# Altium project 724452_RPL-HX_Mobile_AEP_Rev0p91.PrjPcb (part 12 of 13)

## Sheet 0091_USB3.SchDoc
size 848 x 558 mm
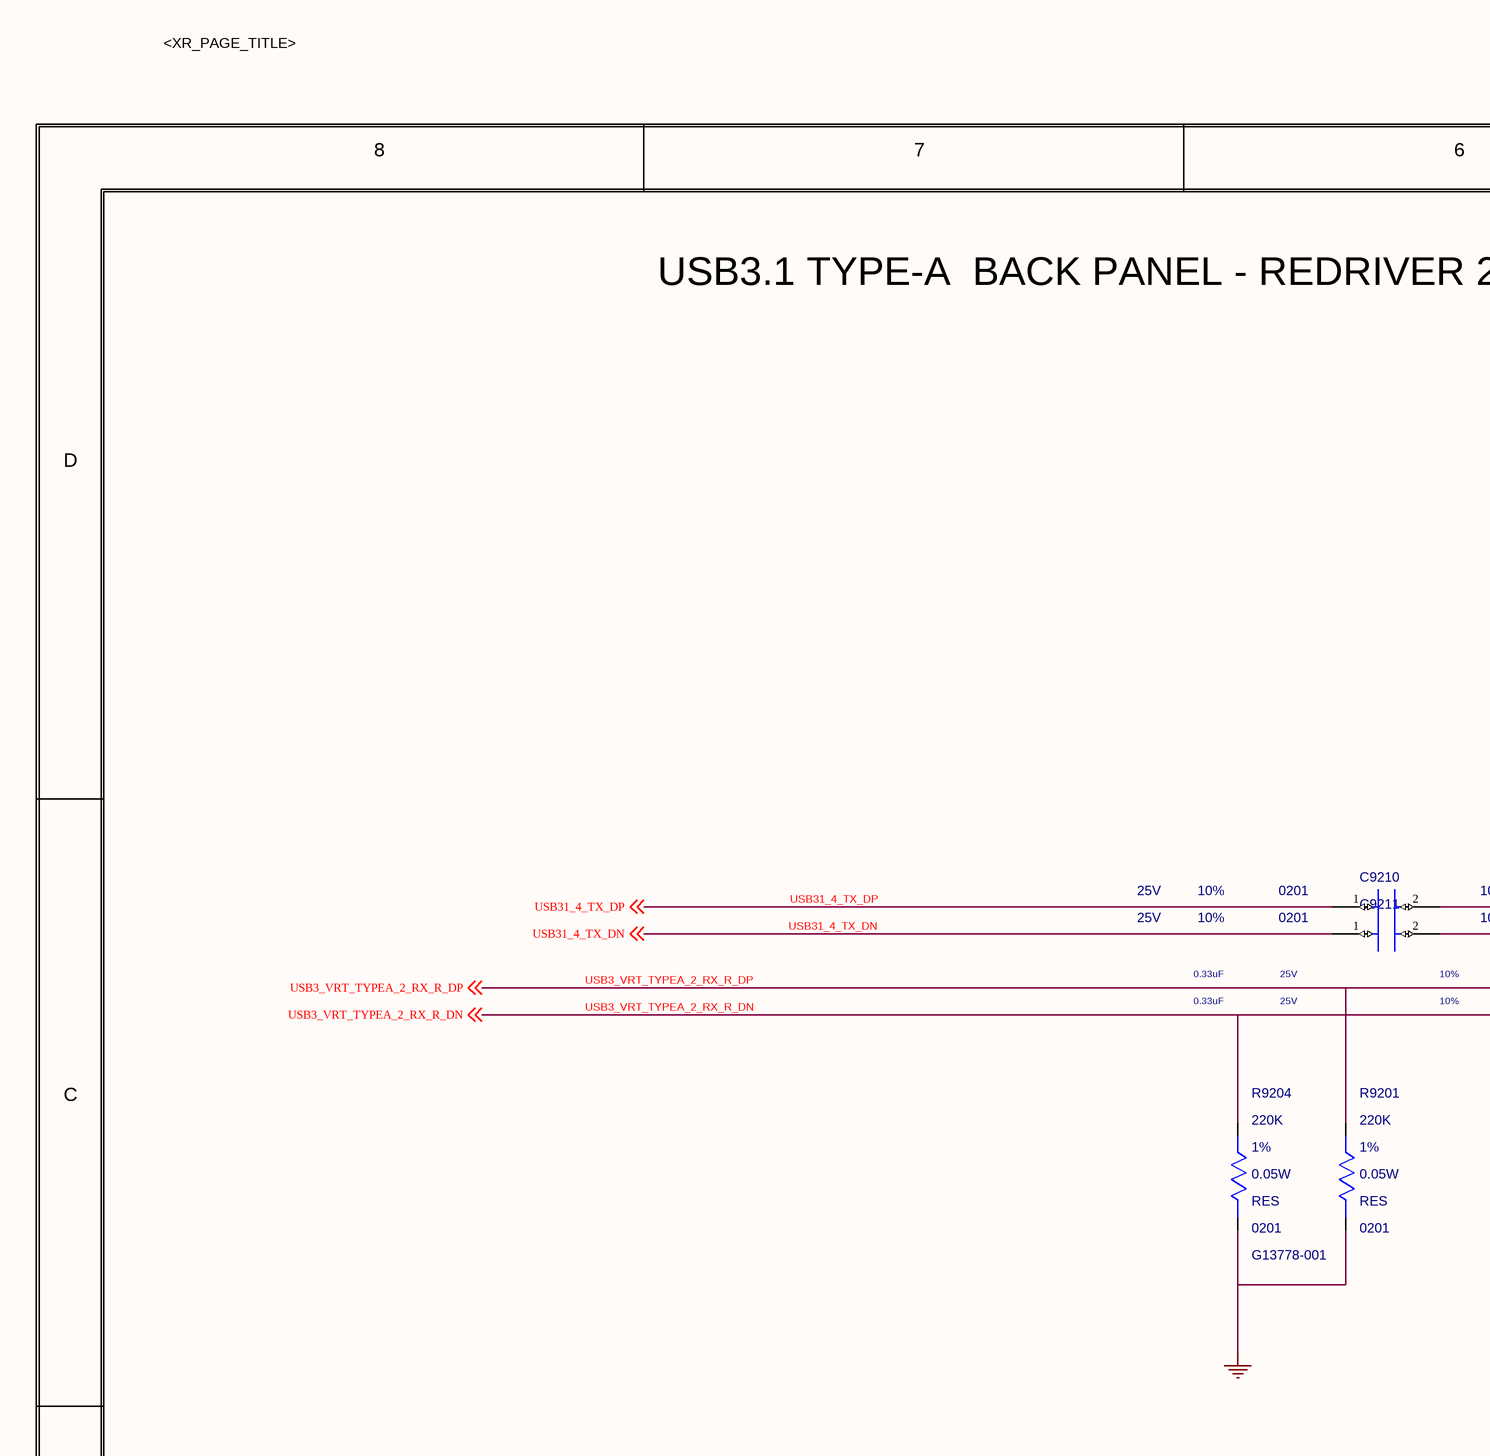
[diagram p154: 0091_USB3.SchDoc, top left]
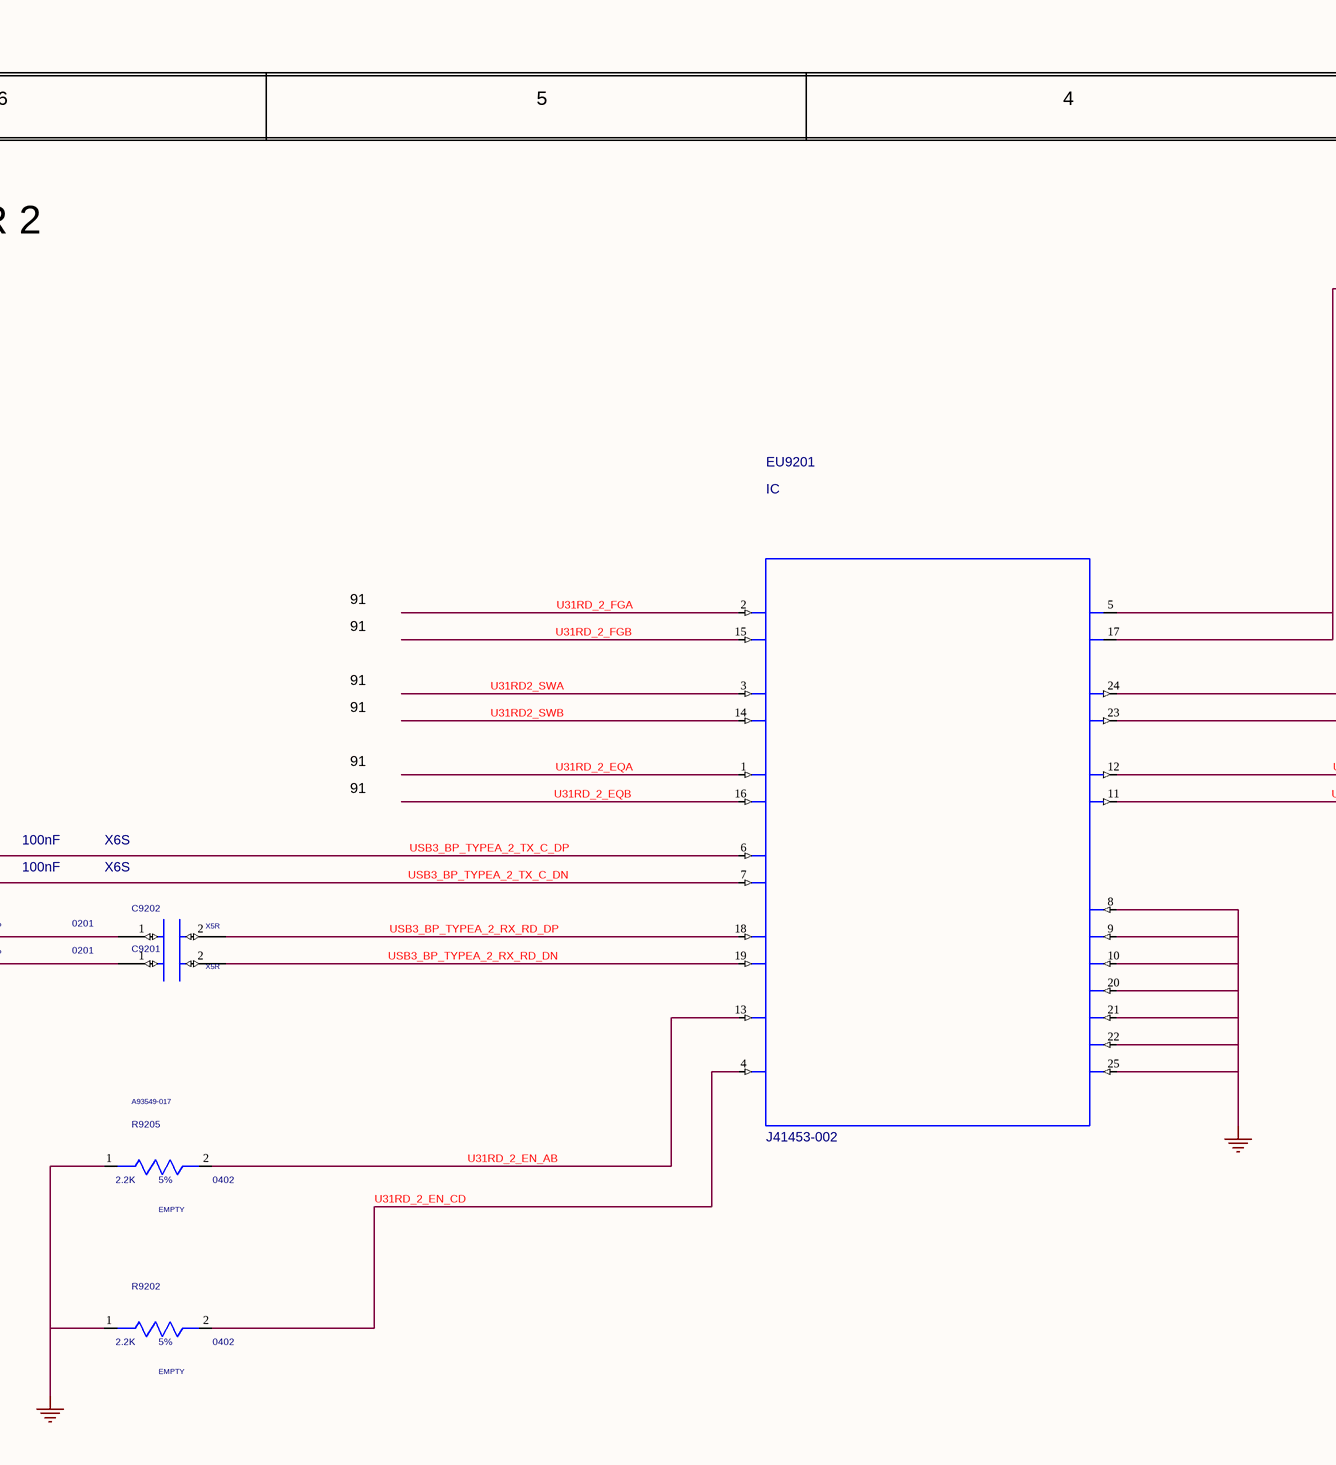
[diagram p155: 0091_USB3.SchDoc, top middle]
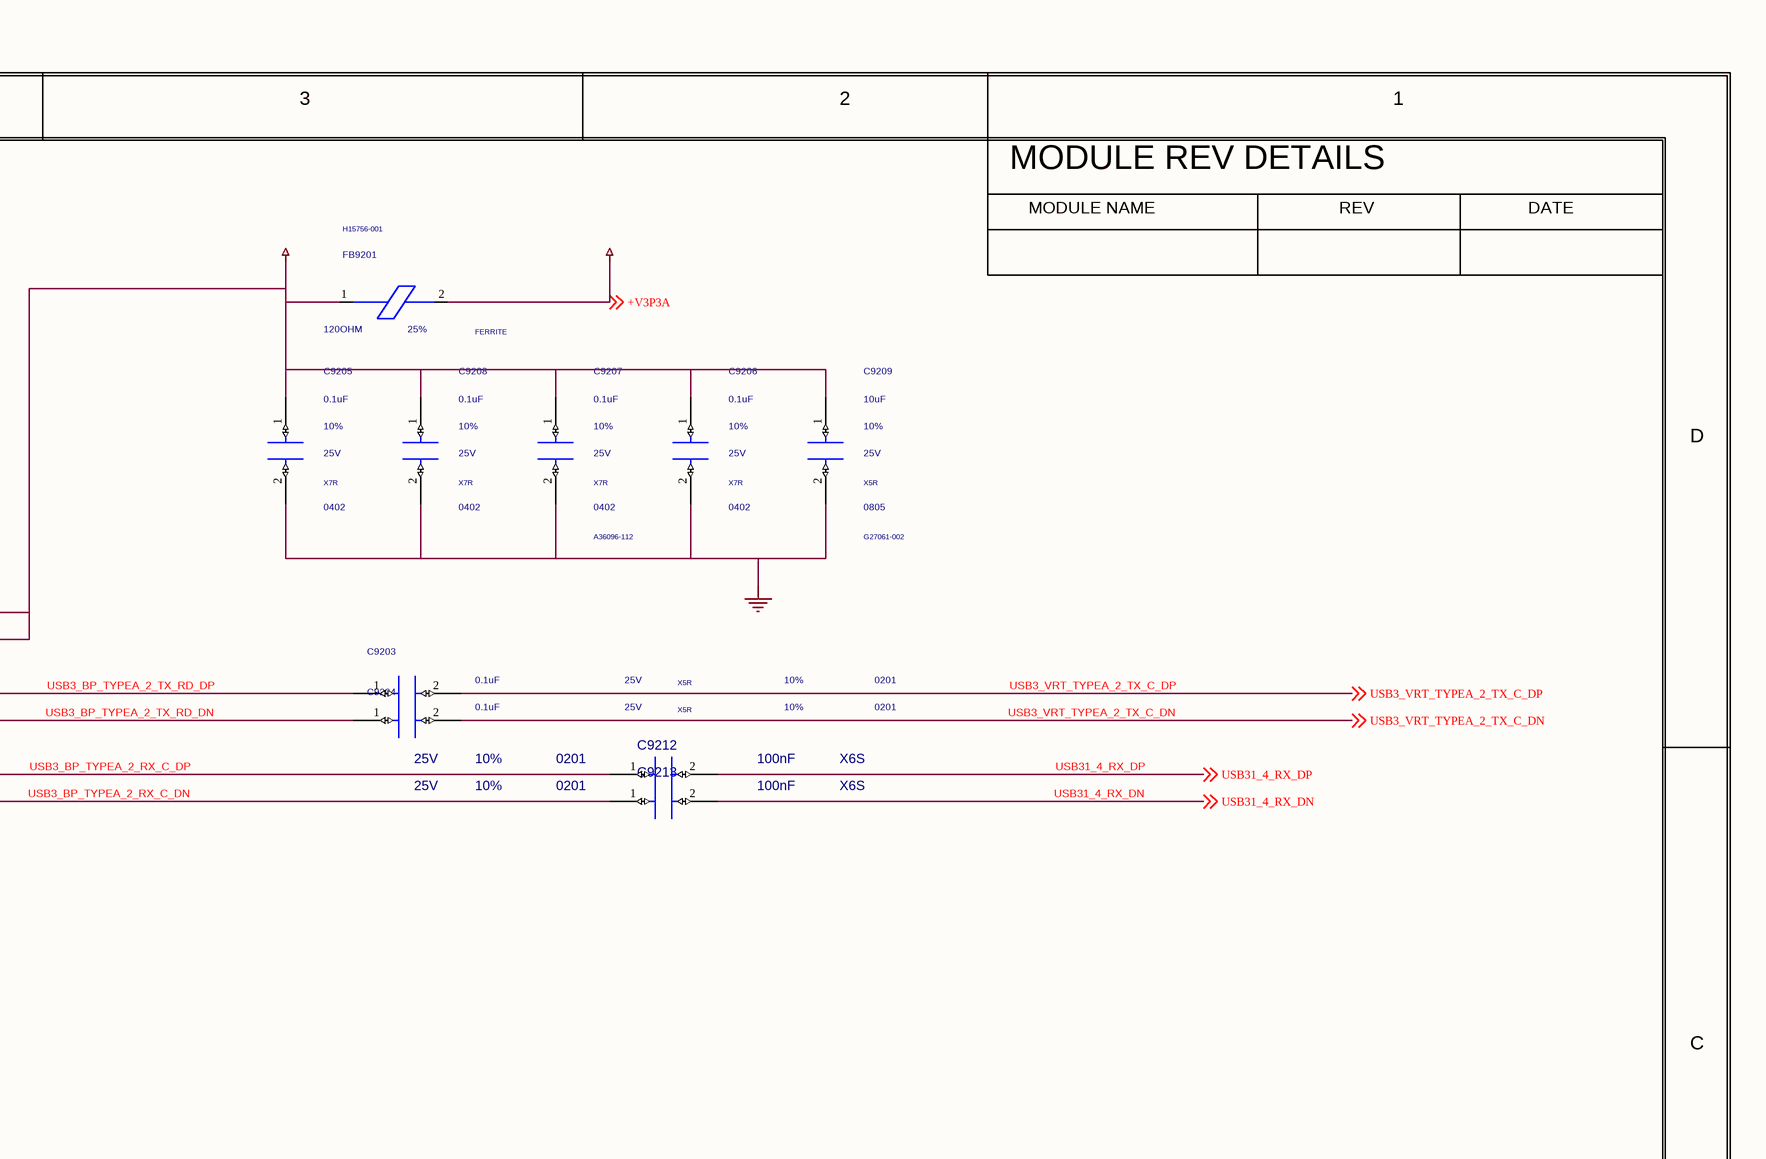
[diagram p156: 0091_USB3.SchDoc, top right]
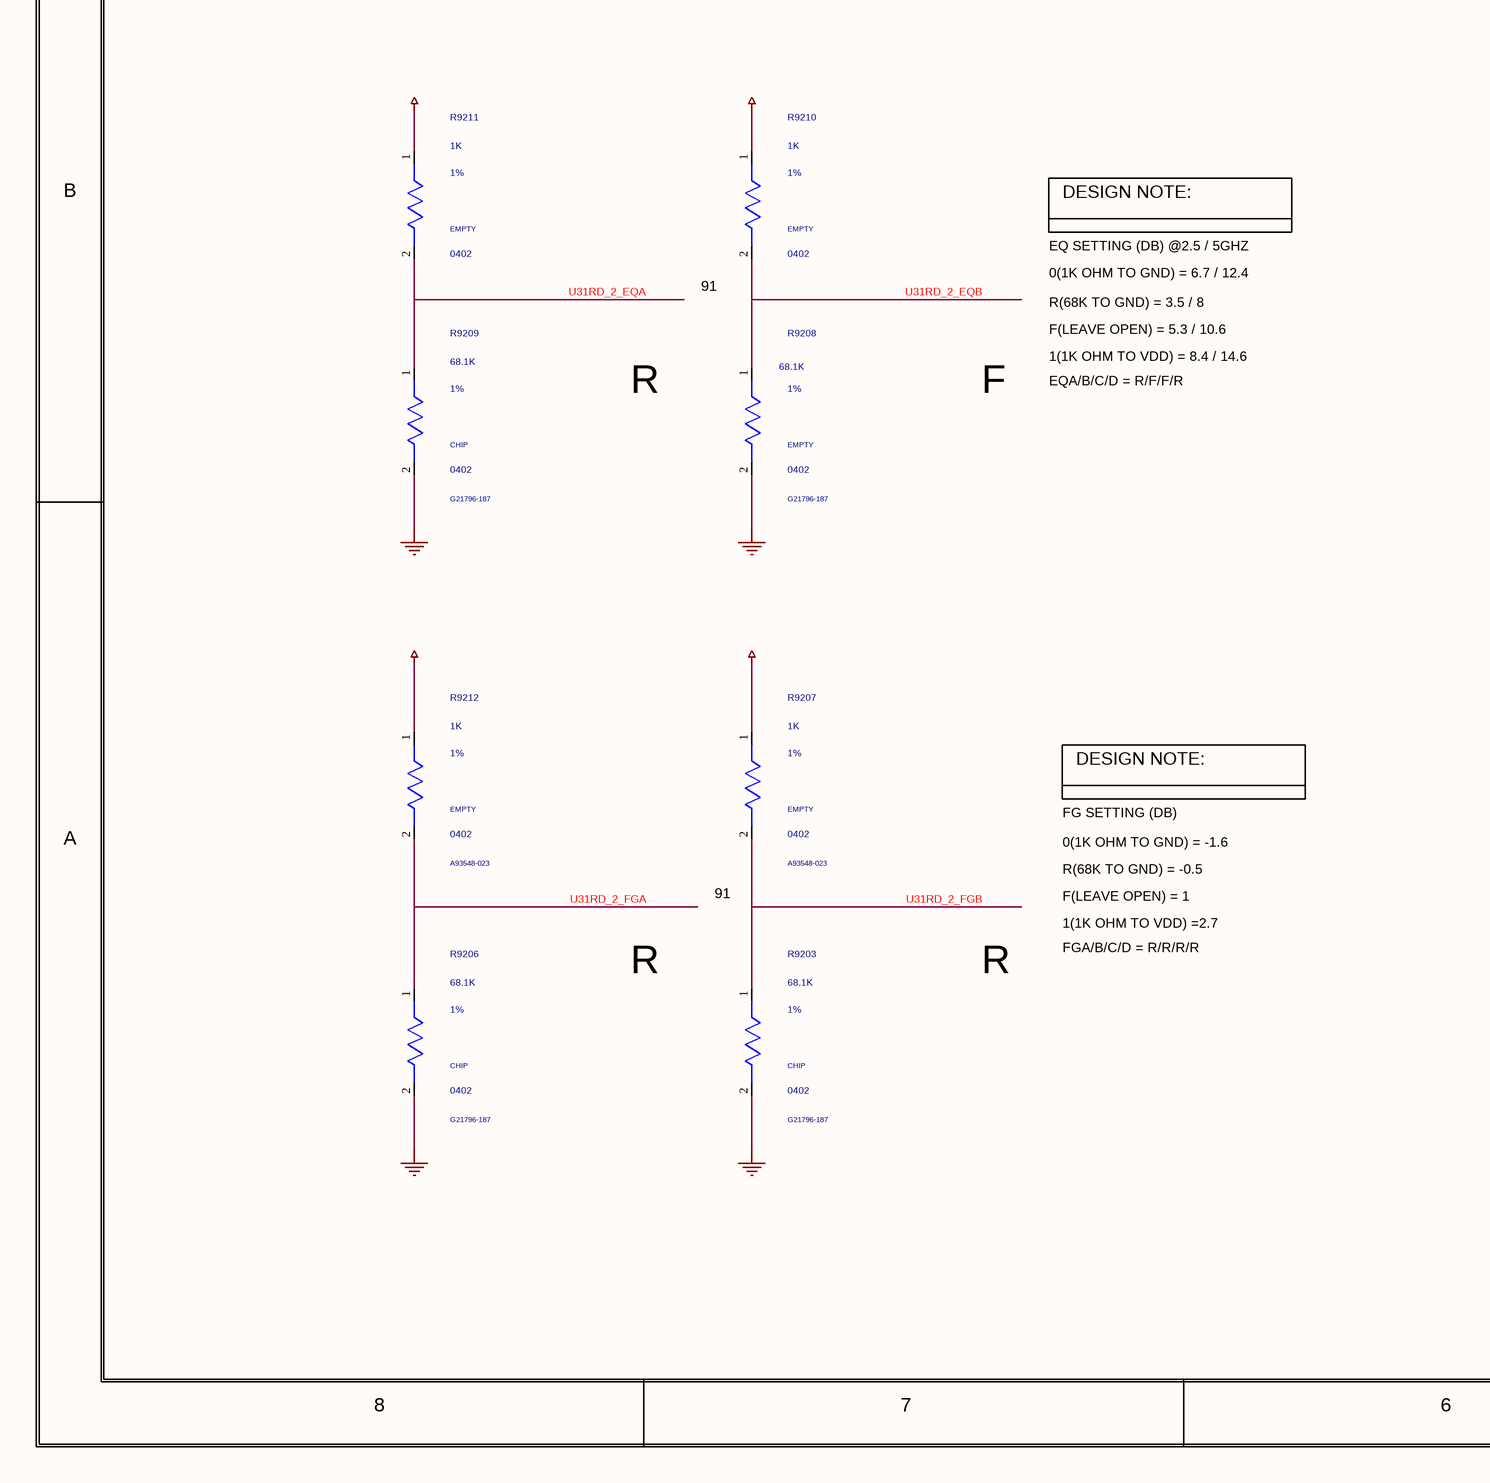
[diagram p157: 0091_USB3.SchDoc, bottom left]
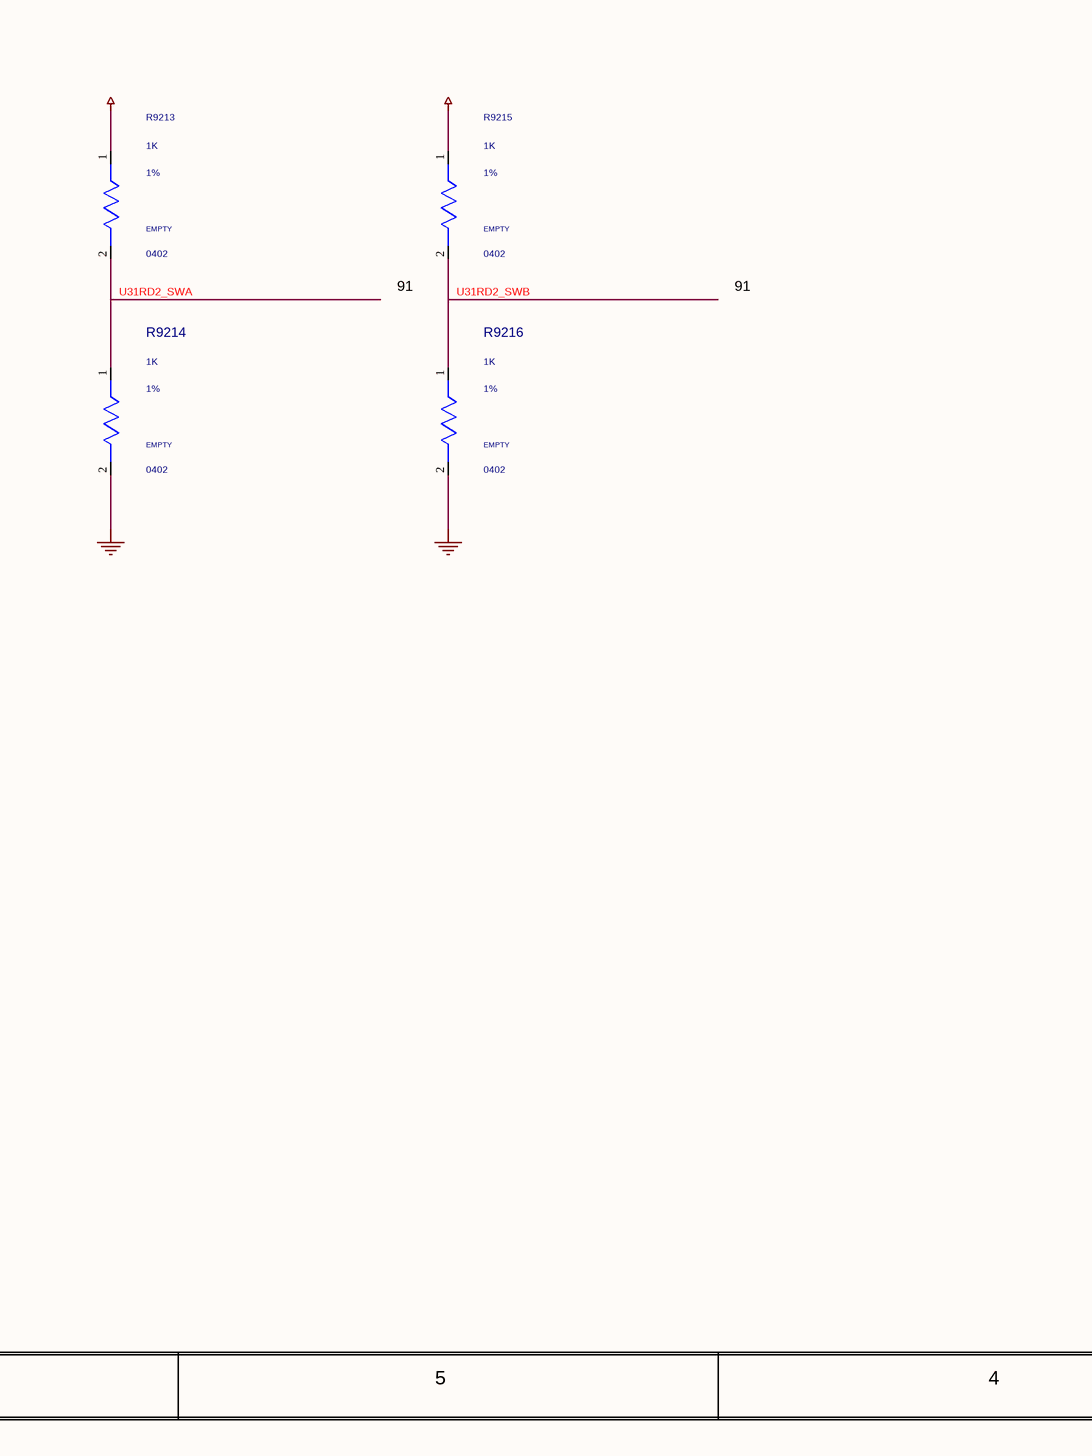
[diagram p158: 0091_USB3.SchDoc, bottom middle]
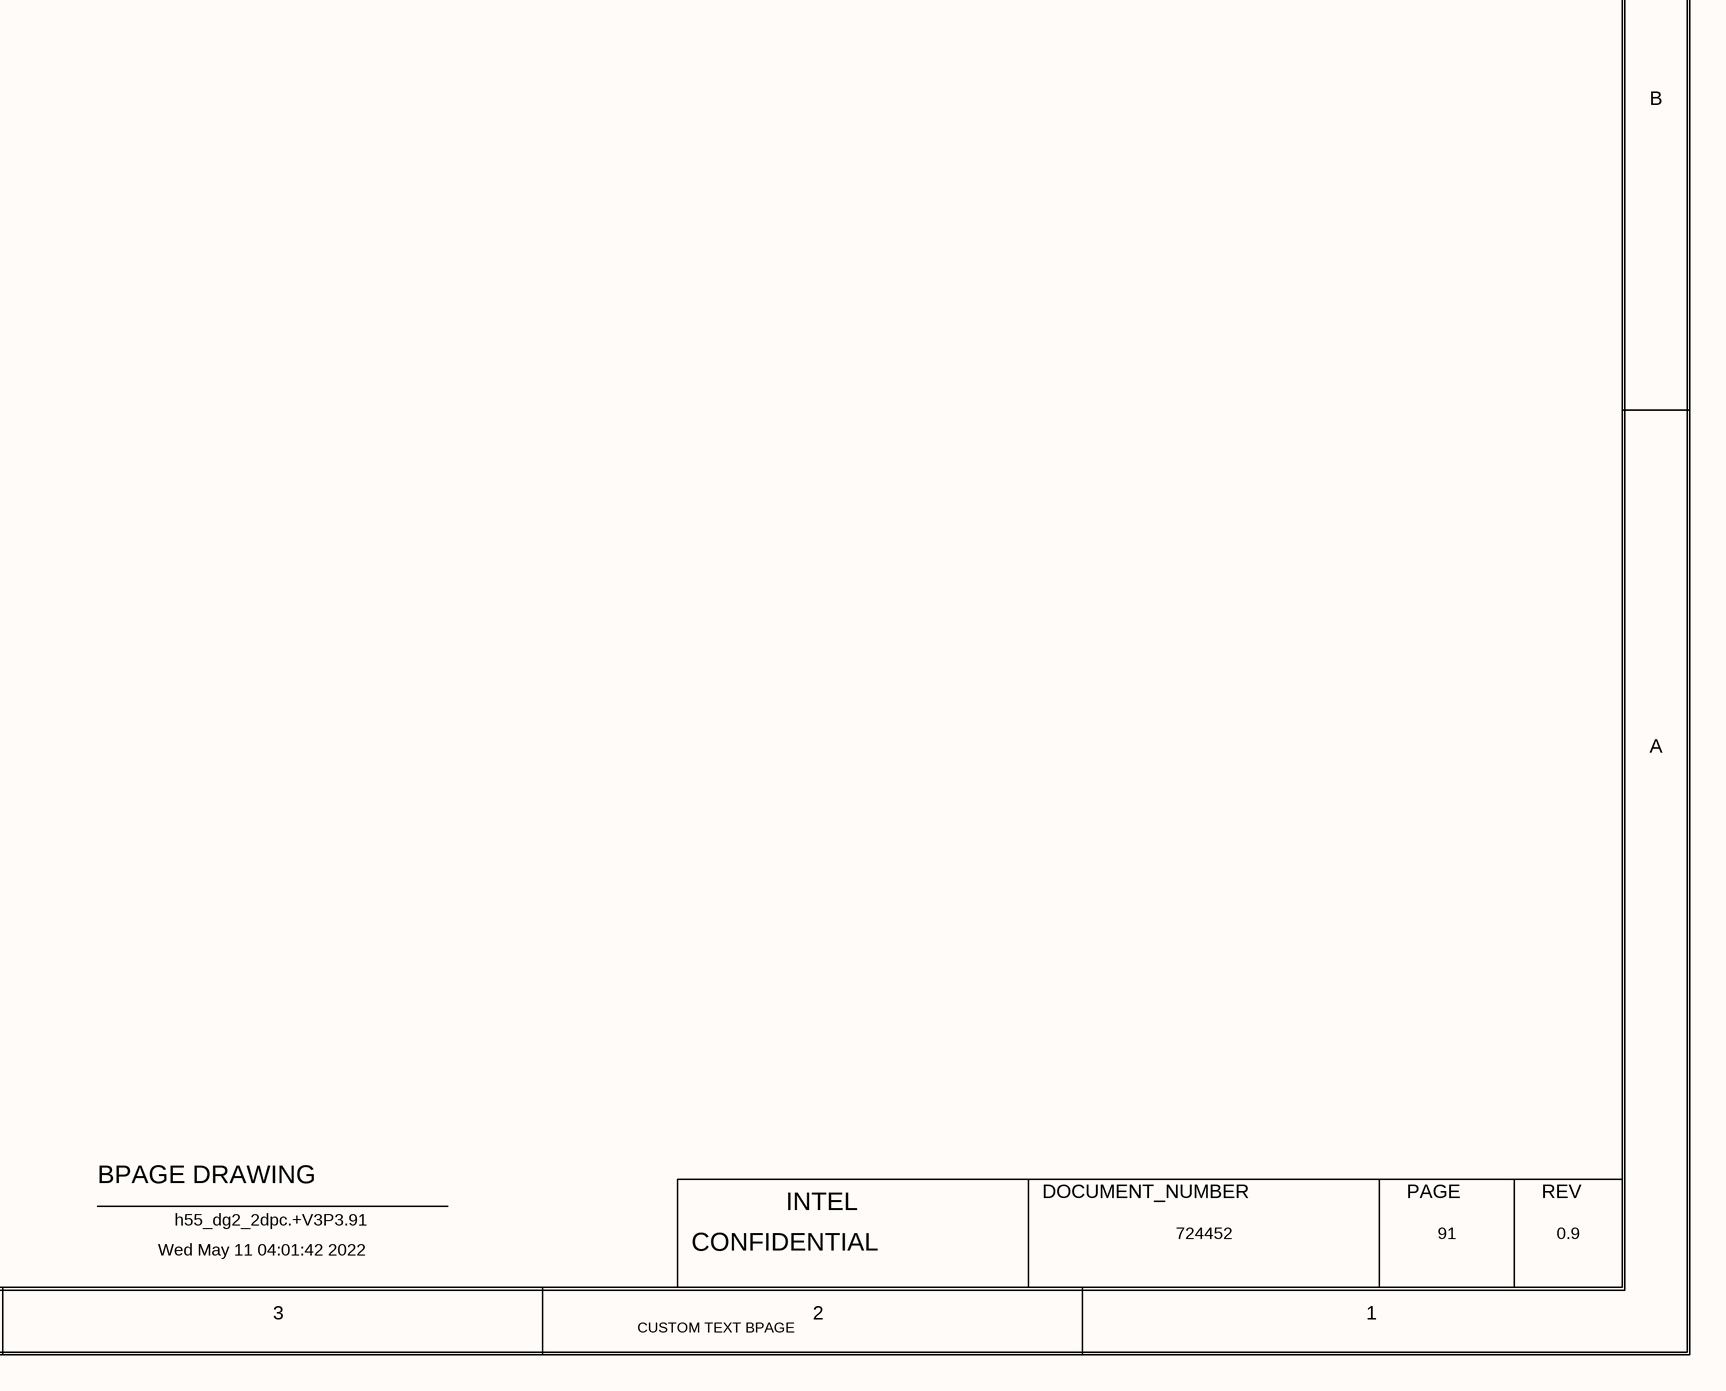
[diagram p159: 0091_USB3.SchDoc, bottom right]

### Parts
C9201  0.33uF  MATERIAL: X5R  PACK_TYPE: 0201  TOLERANCE: 10%  VOLTAGE: 25V  [SMC0201IA]
C9202  0.33uF  MATERIAL: X5R  PACK_TYPE: 0201  TOLERANCE: 10%  VOLTAGE: 25V  [SMC0201IA]
C9203  0.1uF  MATERIAL: X5R  PACK_TYPE: 0201  TOLERANCE: 10%  VOLTAGE: 25V  [SMC0201IA]
C9204  0.1uF  MATERIAL: X5R  PACK_TYPE: 0201  TOLERANCE: 10%  VOLTAGE: 25V  [SMC0201IA]
C9205  0.1uF  MATERIAL: X7R  PACK_TYPE: 0402  TOLERANCE: 10%  VOLTAGE: 25V  [SMC0402IA]
C9206  0.1uF  MATERIAL: X7R  PACK_TYPE: 0402  TOLERANCE: 10%  VOLTAGE: 25V  [SMC0402IA]
C9207  0.1uF  MATERIAL: X7R  PACK_TYPE: 0402  PART_NUMBER: A36096-112  TOLERANCE: 10%  VOLTAGE: 25V  [SMC0402IA]
C9208  0.1uF  MATERIAL: X7R  PACK_TYPE: 0402  TOLERANCE: 10%  VOLTAGE: 25V  [SMC0402IA]
C9209  10uF  MATERIAL: X5R  PACK_TYPE: 0805  PART_NUMBER: G27061-002  TOLERANCE: 10%  VOLTAGE: 25V  [SMC0805MA]
C9210  100nF  MATERIAL: X6S  PACK_TYPE: 0201  TOLERANCE: 10%  VOLTAGE: 25V  [SMC0201IA]
C9211  100nF  MATERIAL: X6S  PACK_TYPE: 0201  TOLERANCE: 10%  VOLTAGE: 25V  [SMC0201IA]
C9212  100nF  MATERIAL: X6S  PACK_TYPE: 0201  TOLERANCE: 10%  VOLTAGE: 25V  [SMC0201IA]
C9213  100nF  MATERIAL: X6S  PACK_TYPE: 0201  TOLERANCE: 10%  VOLTAGE: 25V  [SMC0201IA]
EU9201  MATERIAL: IC  PART_NUMBER: J41453-002  [CTK2_LCC24_S2550_350_DFS1400_MA]  (hidden comment: C_PI3EQX1002E)
FB9201  120OHM  PART_NUMBER: H15756-001  TOLERANCE: 25%  [SFB0603IB]
R9201  220K  MATERIAL: RES  PACK_TYPE: 0201  TOLERANCE: 1%  WATTAGE: 0.05W  [CTK2_SM0201_650X350_MA]
R9202  2.2K  MATERIAL: EMPTY  PACK_TYPE: 0402  TOLERANCE: 5%  [SMR0402IA]
R9203  68.1K  MATERIAL: CHIP  PACK_TYPE: 0402  PART_NUMBER: G21796-187  TOLERANCE: 1%  [SMR0402IA]
R9204  220K  MATERIAL: RES  PACK_TYPE: 0201  PART_NUMBER: G13778-001  TOLERANCE: 1%  WATTAGE: 0.05W  [CTK2_SM0201_650X350_MA]
R9205  2.2K  MATERIAL: EMPTY  PACK_TYPE: 0402  PART_NUMBER: A93549-017  TOLERANCE: 5%  [SMR0402IA]
R9206  68.1K  MATERIAL: CHIP  PACK_TYPE: 0402  PART_NUMBER: G21796-187  TOLERANCE: 1%  [SMR0402IA]
R9207  1K  MATERIAL: EMPTY  PACK_TYPE: 0402  PART_NUMBER: A93548-023  TOLERANCE: 1%  [SMR0402IA]
R9208  68.1K  MATERIAL: EMPTY  PACK_TYPE: 0402  PART_NUMBER: G21796-187  TOLERANCE: 1%  [SMR0402IA]
R9209  68.1K  MATERIAL: CHIP  PACK_TYPE: 0402  PART_NUMBER: G21796-187  TOLERANCE: 1%  [SMR0402IA]
R9210  1K  MATERIAL: EMPTY  PACK_TYPE: 0402  TOLERANCE: 1%  [SMR0402IA]
R9211  1K  MATERIAL: EMPTY  PACK_TYPE: 0402  TOLERANCE: 1%  [SMR0402IA]
R9212  1K  MATERIAL: EMPTY  PACK_TYPE: 0402  PART_NUMBER: A93548-023  TOLERANCE: 1%  [SMR0402IA]
R9213  1K  MATERIAL: EMPTY  PACK_TYPE: 0402  TOLERANCE: 1%  [SMR0402IA]
R9214  1K  MATERIAL: EMPTY  PACK_TYPE: 0402  TOLERANCE: 1%  [SMR0402IA]
R9215  1K  MATERIAL: EMPTY  PACK_TYPE: 0402  TOLERANCE: 1%  [SMR0402IA]
R9216  1K  MATERIAL: EMPTY  PACK_TYPE: 0402  TOLERANCE: 1%  [SMR0402IA]

### Nets
+V3P3_DUAL_USBRD_2: C9205.1(A) C9206.1(A) C9207.1(A) C9208.1(A) C9209.1(A) EU9201.5(VDD_1) EU9201.17(VDD_2) FB9201.1(A) R9207.1(A) R9210.1(A) R9211.1(A) R9212.1(A) R9213.1(A) R9215.1(A)
+V3P3A: FB9201.2(B) ; off-sheet +V3P3A
GND: C9205.2(B) C9206.2(B) C9207.2(B) C9208.2(B) C9209.2(B) EU9201.8(GND_1) EU9201.9(GND_2) EU9201.10(GND_3) EU9201.20(GND_4) EU9201.21(GND_5) EU9201.22(GND_6) EU9201.25(GND_TPD) R9201.2(B) R9202.1(A) R9203.2(B) R9204.2(B) R9205.1(A) R9206.2(B) R9208.2(B) R9209.2(B) R9214.2(B) R9216.2(B)  [project net EXP_A_RX_4_DP]
U31RD2_SWA: EU9201.3(SWA) R9213.2(B) R9214.1(A)
U31RD2_SWB: EU9201.14(SWB) R9215.2(B) R9216.1(A)
U31RD_2_EN_AB: EU9201.13(RXDET_EN) R9205.2(B)
U31RD_2_EN_CD: EU9201.4(EN) R9202.2(B)
U31RD_2_EQA: EU9201.1(EQA) R9209.1(A) R9211.2(B)
U31RD_2_EQB: EU9201.16(EQB) R9208.1(A) R9210.2(B)
U31RD_2_FGA: EU9201.2(FGA) R9206.1(A) R9212.2(B)
U31RD_2_FGB: EU9201.15(FGB) R9203.1(A) R9207.2(B)
USB3_BP_TYPEA_2_RX_C_DN: C9213.1(A) EU9201.11(BON)
USB3_BP_TYPEA_2_RX_C_DP: C9212.1(A) EU9201.12(BOP)
USB3_BP_TYPEA_2_RX_RD_DN: C9201.2(B) EU9201.19(BIN)
USB3_BP_TYPEA_2_RX_RD_DP: C9202.2(B) EU9201.18(BIP)
USB3_BP_TYPEA_2_TX_C_DN: C9211.2(B) EU9201.7(AIN)
USB3_BP_TYPEA_2_TX_C_DP: C9210.2(B) EU9201.6(AIP)
USB3_BP_TYPEA_2_TX_RD_DN: C9204.1(A) EU9201.23(AON)
USB3_BP_TYPEA_2_TX_RD_DP: C9203.1(A) EU9201.24(AOP)
USB3_VRT_TYPEA_2_RX_R_DN: C9201.1(A) R9204.1(A) ; off-sheet USB3_VRT_TYPEA_2_RX_R_DN
USB3_VRT_TYPEA_2_RX_R_DP: C9202.1(A) R9201.1(A) ; off-sheet USB3_VRT_TYPEA_2_RX_R_DP
USB3_VRT_TYPEA_2_TX_C_DN: C9204.2(B) ; off-sheet USB3_VRT_TYPEA_2_TX_C_DN
USB3_VRT_TYPEA_2_TX_C_DP: C9203.2(B) ; off-sheet USB3_VRT_TYPEA_2_TX_C_DP
USB31_4_RX_DN: C9213.2(B) ; off-sheet USB31_4_RX_DN
USB31_4_RX_DP: C9212.2(B) ; off-sheet USB31_4_RX_DP
USB31_4_TX_DN: C9211.1(A) ; off-sheet USB31_4_TX_DN
USB31_4_TX_DP: C9210.1(A) ; off-sheet USB31_4_TX_DP

### Notes on the sheet
- <XR_PAGE_TITLE>
- 8
- 7
- 6
- 5
- 4
- 3
- 2
- 1
- MODULE REV DETAILS
- USB3.1 TYPE-A  BACK PANEL - REDRIVER 2
- MODULE NAME
- REV
- DATE
- D
- 91
- C
- B
- DESIGN NOTE:
- (near R9210) 91
- 0(1K OHM TO GND) = 6.7 / 12.4
- EQ SETTING (DB) @2.5 / 5GHZ
- R(68K TO GND) = 3.5 / 8
- F(LEAVE OPEN) = 5.3 / 10.6
- 1(1K OHM TO VDD) = 8.4 / 14.6
- (near R9215) 91
- R
- F
- EQA/B/C/D = R/F/F/R
- FG SETTING (DB)
- A
- 0(1K OHM TO GND) = -1.6
- R(68K TO GND) = -0.5
- F(LEAVE OPEN) = 1
- 1(1K OHM TO VDD) =2.7
- FGA/B/C/D = R/R/R/R
- BPAGE DRAWING
- INTEL
- DOCUMENT_NUMBER
- PAGE
- Wed May 11 04:01:42 2022
- h55_dg2_2dpc.+V3P3.91
- CONFIDENTIAL
- 724452
- 0.9
- CUSTOM TEXT BPAGE

### Library data of the parts
C9201 = CAP#1: PART_NUMBER: J96611-001; CHIPS_PART_NAME: CAP; CDS_PHYS_PART_NAME: CAP_0201-J96611-001,X5R,0.33UF,25V,10%,LPDB,GENERIC; OriginalSymbolOrigin: (-25,50); XY: (-5600,3500); VER: 2; ROT: 0; PHYS_PAGE: 91; LOCATION: C9201; IP: GENERIC; FP_TECH: LPDB; DRAWING: @RVP1_ADL_SB_ADP_S_DDR5_SODIMM_2DPC_LIB.H55_DG2_2DPC(SCH_1):PAGE462; CDS_LIB: discrete; PCB Footprint: SMC0201IA; SEC_TYPE: 0201; CDS_PART_NAME: CAP_0201-J96611-001,X5R,0.33UF,25V,10%,LPDB,GENERIC; CDS_LOCATION: C9201; ASI_MODEL: J96611-001
C9202 = CAP#1: PART_NUMBER: J96611-001; CHIPS_PART_NAME: CAP; CDS_PHYS_PART_NAME: CAP_0201-J96611-001,X5R,0.33UF,25V,10%,LPDB,GENERIC; OriginalSymbolOrigin: (-25,50); XY: (-5600,3550); VER: 2; ROT: 0; PHYS_PAGE: 91; LOCATION: C9202; IP: GENERIC; FP_TECH: LPDB; DRAWING: @RVP1_ADL_SB_ADP_S_DDR5_SODIMM_2DPC_LIB.H55_DG2_2DPC(SCH_1):PAGE462; CDS_LIB: discrete; PCB Footprint: SMC0201IA; SEC_TYPE: 0201; CDS_PART_NAME: CAP_0201-J96611-001,X5R,0.33UF,25V,10%,LPDB,GENERIC; CDS_LOCATION: C9202; ASI_MODEL: J96611-001
C9203 = CAP#1: PART_NUMBER: C83410-027; CHIPS_PART_NAME: CAP; CDS_PHYS_PART_NAME: CAP_0201-C83410-027,X5R,0.1UF,25V,10%,LPDB,GENERIC; OriginalSymbolOrigin: (-25,50); XY: (-2750,4000); VER: 2; ROT: 0; PHYS_PAGE: 91; LOCATION: C9203; IP: GENERIC; FP_TECH: LPDB; DRAWING: @RVP1_ADL_SB_ADP_S_DDR5_SODIMM_2DPC_LIB.H55_DG2_2DPC(SCH_1):PAGE462; CDS_LIB: discrete; PCB Footprint: SMC0201IA; SEC_TYPE: 0201; CDS_PART_NAME: CAP_0201-C83410-027,X5R,0.1UF,25V,10%,LPDB,GENERIC; CDS_LOCATION: C9203; ASI_MODEL: C83410-027
C9204 = CAP#1: PART_NUMBER: C83410-027; CHIPS_PART_NAME: CAP; CDS_PHYS_PART_NAME: CAP_0201-C83410-027,X5R,0.1UF,25V,10%,LPDB,GENERIC; OriginalSymbolOrigin: (-25,50); XY: (-2750,3950); VER: 2; ROT: 0; PHYS_PAGE: 91; LOCATION: C9204; IP: GENERIC; FP_TECH: LPDB; DRAWING: @RVP1_ADL_SB_ADP_S_DDR5_SODIMM_2DPC_LIB.H55_DG2_2DPC(SCH_1):PAGE462; CDS_LIB: discrete; PCB Footprint: SMC0201IA; SEC_TYPE: 0201; CDS_PART_NAME: CAP_0201-C83410-027,X5R,0.1UF,25V,10%,LPDB,GENERIC; CDS_LOCATION: C9204; ASI_MODEL: C83410-027
C9205 = CAP: PART_NUMBER: A36096-112; CDS_PHYS_PART_NAME: CAP_0402-A36096-112,X7R,0.1UF,25V,10%,LPDB,GENERIC; OriginalSymbolOrigin: (-50,25); XY: (-2975,4450); VER: 1; ROT: 0; PHYS_PAGE: 91; LOCATION: C9205; IP: GENERIC; FP_TECH: LPDB; DRAWING: @RVP1_ADL_SB_ADP_S_DDR5_SODIMM_2DPC_LIB.H55_DG2_2DPC(SCH_1):PAGE462; CDS_LIB: discrete; PCB Footprint: SMC0402IA; CHIPS_PART_NAME: CAP; CDS_PART_NAME: CAP_0402-A36096-112,X7R,0.1UF,25V,10%,LPDB,GENERIC; CDS_LOCATION: C9205; ASI_MODEL: A36096-112
C9206 = CAP: PART_NUMBER: A36096-112; CDS_PHYS_PART_NAME: CAP_0402-A36096-112,X7R,0.1UF,25V,10%,LPDB,GENERIC; OriginalSymbolOrigin: (-50,25); XY: (-2225,4450); VER: 1; ROT: 0; PHYS_PAGE: 91; LOCATION: C9206; IP: GENERIC; FP_TECH: LPDB; DRAWING: @RVP1_ADL_SB_ADP_S_DDR5_SODIMM_2DPC_LIB.H55_DG2_2DPC(SCH_1):PAGE462; CDS_LIB: discrete; PCB Footprint: SMC0402IA; CHIPS_PART_NAME: CAP; CDS_PART_NAME: CAP_0402-A36096-112,X7R,0.1UF,25V,10%,LPDB,GENERIC; CDS_LOCATION: C9206; ASI_MODEL: A36096-112
C9207 = CAP: CDS_PHYS_PART_NAME: CAP_0402-A36096-112,X7R,0.1UF,25V,10%,LPDB,GENERIC; OriginalSymbolOrigin: (-50,25); XY: (-2475,4450); VER: 1; ROT: 0; PHYS_PAGE: 91; LOCATION: C9207; IP: GENERIC; FP_TECH: LPDB; DRAWING: @RVP1_ADL_SB_ADP_S_DDR5_SODIMM_2DPC_LIB.H55_DG2_2DPC(SCH_1):PAGE462; CDS_LIB: discrete; PCB Footprint: SMC0402IA; CHIPS_PART_NAME: CAP; CDS_PART_NAME: CAP_0402-A36096-112,X7R,0.1UF,25V,10%,LPDB,GENERIC; CDS_LOCATION: C9207; ASI_MODEL: A36096-112
C9208 = CAP: PART_NUMBER: A36096-112; CDS_PHYS_PART_NAME: CAP_0402-A36096-112,X7R,0.1UF,25V,10%,LPDB,GENERIC; OriginalSymbolOrigin: (-50,25); XY: (-2725,4450); VER: 1; ROT: 0; PHYS_PAGE: 91; LOCATION: C9208; IP: GENERIC; FP_TECH: LPDB; DRAWING: @RVP1_ADL_SB_ADP_S_DDR5_SODIMM_2DPC_LIB.H55_DG2_2DPC(SCH_1):PAGE462; CDS_LIB: discrete; PCB Footprint: SMC0402IA; CHIPS_PART_NAME: CAP; CDS_PART_NAME: CAP_0402-A36096-112,X7R,0.1UF,25V,10%,LPDB,GENERIC; CDS_LOCATION: C9208; ASI_MODEL: A36096-112
C9209 = CAP: CDS_PHYS_PART_NAME: CAP_0805-G27061-002,X5R,10UF,25V,10%,LPDB,GENERIC; OriginalSymbolOrigin: (-50,25); XY: (-1975,4450); VER: 1; ROT: 0; PHYS_PAGE: 91; LOCATION: C9209; IP: GENERIC; FP_TECH: LPDB; DRAWING: @RVP1_ADL_SB_ADP_S_DDR5_SODIMM_2DPC_LIB.H55_DG2_2DPC(SCH_1):PAGE462; CDS_LIB: discrete; PCB Footprint: SMC0805MA; CHIPS_PART_NAME: CAP; CDS_PART_NAME: CAP_0805-G27061-002,X5R,10UF,25V,10%,LPDB,GENERIC; CDS_LOCATION: C9209; ASI_MODEL: G27061-002
C9210 = CAP#1: PART_NUMBER: H68299-001; CHIPS_PART_NAME: CAP; CDS_PHYS_PART_NAME: CAP_0201-H68299-001,X6S,100NF,25V,10%,LPDB,GENERIC; OriginalSymbolOrigin: (-25,50); XY: (-6050,3700); VER: 2; ROT: 0; PHYS_PAGE: 91; LOCATION: C9210; IP: GENERIC; FP_TECH: LPDB; DRAWING: @RVP1_ADL_SB_ADP_S_DDR5_SODIMM_2DPC_LIB.H55_DG2_2DPC(SCH_1):PAGE462; CDS_LIB: discrete; PCB Footprint: SMC0201IA; CDS_PART_NAME: CAP_0201-H68299-001,X6S,100NF,25V,10%,LPDB,GENERIC; CDS_LOCATION: C9210
C9211 = CAP#1: PART_NUMBER: H68299-001; CHIPS_PART_NAME: CAP; CDS_PHYS_PART_NAME: CAP_0201-H68299-001,X6S,100NF,25V,10%,LPDB,GENERIC; OriginalSymbolOrigin: (-25,50); XY: (-6050,3650); VER: 2; ROT: 0; PHYS_PAGE: 91; LOCATION: C9211; IP: GENERIC; FP_TECH: LPDB; DRAWING: @RVP1_ADL_SB_ADP_S_DDR5_SODIMM_2DPC_LIB.H55_DG2_2DPC(SCH_1):PAGE462; CDS_LIB: discrete; PCB Footprint: SMC0201IA; CDS_PART_NAME: CAP_0201-H68299-001,X6S,100NF,25V,10%,LPDB,GENERIC; CDS_LOCATION: C9211
C9212 = CAP#1: PART_NUMBER: H68299-001; CHIPS_PART_NAME: CAP; CDS_PHYS_PART_NAME: CAP_0201-H68299-001,X6S,100NF,25V,10%,LPDB,GENERIC; OriginalSymbolOrigin: (-25,50); XY: (-2275,3850); VER: 2; ROT: 0; PHYS_PAGE: 91; LOCATION: C9212; IP: GENERIC; FP_TECH: LPDB; DRAWING: @RVP1_ADL_SB_ADP_S_DDR5_SODIMM_2DPC_LIB.H55_DG2_2DPC(SCH_1):PAGE462; CDS_LIB: discrete; PCB Footprint: SMC0201IA; CDS_PART_NAME: CAP_0201-H68299-001,X6S,100NF,25V,10%,LPDB,GENERIC; CDS_LOCATION: C9212
C9213 = CAP#1: PART_NUMBER: H68299-001; CHIPS_PART_NAME: CAP; CDS_PHYS_PART_NAME: CAP_0201-H68299-001,X6S,100NF,25V,10%,LPDB,GENERIC; OriginalSymbolOrigin: (-25,50); XY: (-2275,3800); VER: 2; ROT: 0; PHYS_PAGE: 91; LOCATION: C9213; IP: GENERIC; FP_TECH: LPDB; DRAWING: @RVP1_ADL_SB_ADP_S_DDR5_SODIMM_2DPC_LIB.H55_DG2_2DPC(SCH_1):PAGE462; CDS_LIB: discrete; PCB Footprint: SMC0201IA; CDS_PART_NAME: CAP_0201-H68299-001,X6S,100NF,25V,10%,LPDB,GENERIC; CDS_LOCATION: C9213
EU9201 = C_PI3EQX1002E: CDS_PHYS_PART_NAME: C_PI3EQX1002E_LCC-J41453-002,IC,PI3EQX1002E2ZREX,TK2,GENERIC; CDS_LMAN_SYM_OUTLINE: -300,550,300,-500; FP_TECH: TK2; IP: GENERIC; PACK_TYPE: LCC; ROOM: NONE; OriginalSymbolOrigin: (-325,550); XY: (-4200,3700); VER: 1; ROT: 0; PHYS_PAGE: 91; LOCATION: EU9201; DRAWING: @RVP1_ADL_SB_ADP_S_DDR5_SODIMM_2DPC_LIB.H55_DG2_2DPC(SCH_1):PAGE462; CDS_LIB: local; VARIANT: ?; PCB Footprint: CTK2_LCC24_S2550_350_DFS1400_MA; SEC_TYPE: LCC; CHIPS_PART_NAME: C_PI3EQX1002E; CDS_PART_NAME: C_PI3EQX1002E_LCC-J41453-002,IC,PI3EQX1002E2ZREX,TK2,GENERIC; CDS_LOCATION: EU9201
FB9201 = FERRITE: CDS_PHYS_PART_NAME: FERRITE_0603-H15756-001,FERRITE,120OHM,25%,3A,LPDB,GENERIC; CURRENT: 3A; PACK_TYPE: 0603; OriginalSymbolOrigin: (-75,50); XY: (-2775,4725); VER: 1; ROT: 0; PHYS_PAGE: 91; LOCATION: FB9201; IP: GENERIC; FP_TECH: LPDB; DRAWING: @RVP1_ADL_SB_ADP_S_DDR5_SODIMM_2DPC_LIB.H55_DG2_2DPC(SCH_1):PAGE462; CDS_LIB: discrete; MATERIAL: FERRITE; PCB Footprint: SFB0603IB; SEC_TYPE: 0603; CHIPS_PART_NAME: FERRITE; CDS_PART_NAME: FERRITE_0603-H15756-001,FERRITE,120OHM,25%,3A,LPDB,GENERIC; CDS_LOCATION: FB9201
R9201 = C_RES: PART_NUMBER: G13778-001; CDS_PHYS_PART_NAME: C_RES_0201-G13778-001,RES,220K,1%,0.05W,TK2,GENERIC; CDS_LMAN_SYM_OUTLINE: -50,50,50,-50; FP_TECH: TK2; IP: GENERIC; ROOM: NONE; OriginalSymbolOrigin: (-25,75); XY: (-6125,3200); VER: 2; ROT: 0; PHYS_PAGE: 91; LOCATION: R9201; DRAWING: @RVP1_ADL_SB_ADP_S_DDR5_SODIMM_2DPC_LIB.H55_DG2_2DPC(SCH_1):PAGE462; CDS_LIB: c_discrete; VARIANT: ?; PCB Footprint: CTK2_SM0201_650X350_MA; CHIPS_PART_NAME: C_RES; CDS_PART_NAME: C_RES_0201-G13778-001,RES,220K,1%,0.05W,TK2,GENERIC; CDS_LOCATION: R9201
R9202 = RES#1: PART_NUMBER: A93549-017; CHIPS_PART_NAME: RES; CDS_PHYS_PART_NAME: RES_0402-A93549-017,EMPTY,2.2K,5%,1/16W,LPDB,GENERIC; WATTAGE: 1/16W; OriginalSymbolOrigin: (-75,25); XY: (-5625,2825); VER: 1; ROT: 0; PHYS_PAGE: 91; LOCATION: R9202; IP: GENERIC; FP_TECH: LPDB; DRAWING: @RVP1_ADL_SB_ADP_S_DDR5_SODIMM_2DPC_LIB.H55_DG2_2DPC(SCH_1):PAGE462; CDS_LIB: discrete; PCB Footprint: SMR0402IA; SEC_TYPE: 0402; CDS_PART_NAME: RES_0402-A93549-017,EMPTY,2.2K,5%,1/16W,LPDB,GENERIC; CDS_LOCATION: R9202; ASI_MODEL: A93549-017
R9203 = RES: CDS_PHYS_PART_NAME: RES_0402-G21796-187,CHIP,68.1K,1%,1/16W,LPDB,GENERIC; WATTAGE: 1/16W; OriginalSymbolOrigin: (-25,75); XY: (-7225,650); VER: 2; ROT: 0; PHYS_PAGE: 91; LOCATION: R9203; IP: GENERIC; FP_TECH: LPDB; DRAWING: @RVP1_ADL_SB_ADP_S_DDR5_SODIMM_2DPC_LIB.H55_DG2_2DPC(SCH_1):PAGE462; CDS_LIB: discrete; PCB Footprint: SMR0402IA; SEC_TYPE: 0402; CHIPS_PART_NAME: RES; CDS_PART_NAME: RES_0402-G21796-187,CHIP,68.1K,1%,1/16W,LPDB,GENERIC; CDS_LOCATION: R9203; ASI_MODEL: G21796-187
R9204 = C_RES: CDS_PHYS_PART_NAME: C_RES_0201-G13778-001,RES,220K,1%,0.05W,TK2,GENERIC; CDS_LMAN_SYM_OUTLINE: -50,50,50,-50; FP_TECH: TK2; IP: GENERIC; ROOM: NONE; OriginalSymbolOrigin: (-25,75); XY: (-6325,3200); VER: 2; ROT: 0; PHYS_PAGE: 91; LOCATION: R9204; DRAWING: @RVP1_ADL_SB_ADP_S_DDR5_SODIMM_2DPC_LIB.H55_DG2_2DPC(SCH_1):PAGE462; CDS_LIB: c_discrete; VARIANT: ?; PCB Footprint: CTK2_SM0201_650X350_MA; CHIPS_PART_NAME: C_RES; CDS_PART_NAME: C_RES_0201-G13778-001,RES,220K,1%,0.05W,TK2,GENERIC; CDS_LOCATION: R9204
R9205 = RES#1: CHIPS_PART_NAME: RES; CDS_PHYS_PART_NAME: RES_0402-A93549-017,EMPTY,2.2K,5%,1/16W,LPDB,GENERIC; WATTAGE: 1/16W; OriginalSymbolOrigin: (-75,25); XY: (-5625,3125); VER: 1; ROT: 0; PHYS_PAGE: 91; LOCATION: R9205; IP: GENERIC; FP_TECH: LPDB; DRAWING: @RVP1_ADL_SB_ADP_S_DDR5_SODIMM_2DPC_LIB.H55_DG2_2DPC(SCH_1):PAGE462; CDS_LIB: discrete; PCB Footprint: SMR0402IA; SEC_TYPE: 0402; CDS_PART_NAME: RES_0402-A93549-017,EMPTY,2.2K,5%,1/16W,LPDB,GENERIC; CDS_LOCATION: R9205; ASI_MODEL: A93549-017
R9206 = RES: CDS_PHYS_PART_NAME: RES_0402-G21796-187,CHIP,68.1K,1%,1/16W,LPDB,GENERIC; WATTAGE: 1/16W; OriginalSymbolOrigin: (-25,75); XY: (-7850,650); VER: 2; ROT: 0; PHYS_PAGE: 91; LOCATION: R9206; IP: GENERIC; FP_TECH: LPDB; DRAWING: @RVP1_ADL_SB_ADP_S_DDR5_SODIMM_2DPC_LIB.H55_DG2_2DPC(SCH_1):PAGE462; CDS_LIB: discrete; PCB Footprint: SMR0402IA; SEC_TYPE: 0402; CHIPS_PART_NAME: RES; CDS_PART_NAME: RES_0402-G21796-187,CHIP,68.1K,1%,1/16W,LPDB,GENERIC; CDS_LOCATION: R9206; ASI_MODEL: G21796-187
R9207 = RES: CDS_PHYS_PART_NAME: RES_0402-A93548-023,EMPTY,1K,1%,1/16W,LPDB,GENERIC; WATTAGE: 1/16W; OriginalSymbolOrigin: (-25,75); XY: (-7225,1125); VER: 2; ROT: 0; PHYS_PAGE: 91; LOCATION: R9207; IP: GENERIC; FP_TECH: LPDB; DRAWING: @RVP1_ADL_SB_ADP_S_DDR5_SODIMM_2DPC_LIB.H55_DG2_2DPC(SCH_1):PAGE462; CDS_LIB: discrete; PCB Footprint: SMR0402IA; CHIPS_PART_NAME: RES; CDS_PART_NAME: RES_0402-A93548-023,EMPTY,1K,1%,1/16W,LPDB,GENERIC; CDS_LOCATION: R9207; ASI_MODEL: A93548-023
R9208 = RES: CDS_PHYS_PART_NAME: RES_0402-G21796-187,EMPTY,68.1K,1%,1/16W,LPDB,GENERIC; WATTAGE: 1/16W; OriginalSymbolOrigin: (-25,75); XY: (-7225,1800); VER: 2; ROT: 0; PHYS_PAGE: 91; LOCATION: R9208; IP: GENERIC; FP_TECH: LPDB; DRAWING: @RVP1_ADL_SB_ADP_S_DDR5_SODIMM_2DPC_LIB.H55_DG2_2DPC(SCH_1):PAGE462; CDS_LIB: discrete; PCB Footprint: SMR0402IA; CHIPS_PART_NAME: RES; CDS_PART_NAME: RES_0402-G21796-187,EMPTY,68.1K,1%,1/16W,LPDB,GENERIC; CDS_LOCATION: R9208; ASI_MODEL: G21796-187
R9209 = RES: CDS_PHYS_PART_NAME: RES_0402-G21796-187,CHIP,68.1K,1%,1/16W,LPDB,GENERIC; WATTAGE: 1/16W; OriginalSymbolOrigin: (-25,75); XY: (-7850,1800); VER: 2; ROT: 0; PHYS_PAGE: 91; LOCATION: R9209; IP: GENERIC; FP_TECH: LPDB; DRAWING: @RVP1_ADL_SB_ADP_S_DDR5_SODIMM_2DPC_LIB.H55_DG2_2DPC(SCH_1):PAGE462; CDS_LIB: discrete; PCB Footprint: SMR0402IA; CHIPS_PART_NAME: RES; CDS_PART_NAME: RES_0402-G21796-187,CHIP,68.1K,1%,1/16W,LPDB,GENERIC; CDS_LOCATION: R9209; ASI_MODEL: G21796-187
R9210 = RES: PART_NUMBER: A93548-023; CDS_PHYS_PART_NAME: RES_0402-A93548-023,EMPTY,1K,1%,1/16W,LPDB,GENERIC; WATTAGE: 1/16W; OriginalSymbolOrigin: (-25,75); XY: (-7225,2200); VER: 2; ROT: 0; PHYS_PAGE: 91; LOCATION: R9210; IP: GENERIC; FP_TECH: LPDB; DRAWING: @RVP1_ADL_SB_ADP_S_DDR5_SODIMM_2DPC_LIB.H55_DG2_2DPC(SCH_1):PAGE462; CDS_LIB: discrete; PCB Footprint: SMR0402IA; CHIPS_PART_NAME: RES; CDS_PART_NAME: RES_0402-A93548-023,EMPTY,1K,1%,1/16W,LPDB,GENERIC; CDS_LOCATION: R9210; ASI_MODEL: A93548-023
R9211 = RES: PART_NUMBER: A93548-023; CDS_PHYS_PART_NAME: RES_0402-A93548-023,EMPTY,1K,1%,1/16W,LPDB,GENERIC; WATTAGE: 1/16W; OriginalSymbolOrigin: (-25,75); XY: (-7850,2200); VER: 2; ROT: 0; PHYS_PAGE: 91; LOCATION: R9211; IP: GENERIC; FP_TECH: LPDB; DRAWING: @RVP1_ADL_SB_ADP_S_DDR5_SODIMM_2DPC_LIB.H55_DG2_2DPC(SCH_1):PAGE462; CDS_LIB: discrete; PCB Footprint: SMR0402IA; CHIPS_PART_NAME: RES; CDS_PART_NAME: RES_0402-A93548-023,EMPTY,1K,1%,1/16W,LPDB,GENERIC; CDS_LOCATION: R9211; ASI_MODEL: A93548-023
R9212 = RES: CDS_PHYS_PART_NAME: RES_0402-A93548-023,EMPTY,1K,1%,1/16W,LPDB,GENERIC; WATTAGE: 1/16W; OriginalSymbolOrigin: (-25,75); XY: (-7850,1125); VER: 2; ROT: 0; PHYS_PAGE: 91; LOCATION: R9212; IP: GENERIC; FP_TECH: LPDB; DRAWING: @RVP1_ADL_SB_ADP_S_DDR5_SODIMM_2DPC_LIB.H55_DG2_2DPC(SCH_1):PAGE462; CDS_LIB: discrete; PCB Footprint: SMR0402IA; CHIPS_PART_NAME: RES; CDS_PART_NAME: RES_0402-A93548-023,EMPTY,1K,1%,1/16W,LPDB,GENERIC; CDS_LOCATION: R9212; ASI_MODEL: A93548-023
R9213 = RES: PART_NUMBER: A93548-023; CDS_PHYS_PART_NAME: RES_0402-A93548-023,EMPTY,1K,1%,1/16W,LPDB,GENERIC; WATTAGE: 1/16W; OriginalSymbolOrigin: (-25,75); XY: (-5550,2150); VER: 2; ROT: 0; PHYS_PAGE: 91; LOCATION: R9213; IP: GENERIC; FP_TECH: LPDB; DRAWING: @RVP1_ADL_SB_ADP_S_DDR5_SODIMM_2DPC_LIB.H55_DG2_2DPC(SCH_1):PAGE462; CDS_LIB: discrete; PCB Footprint: SMR0402IA; CHIPS_PART_NAME: RES; CDS_PART_NAME: RES_0402-A93548-023,EMPTY,1K,1%,1/16W,LPDB,GENERIC; CDS_LOCATION: R9213; ASI_MODEL: A93548-023
R9214 = RES: PART_NUMBER: A93548-023; CDS_PHYS_PART_NAME: RES_0402-A93548-023,EMPTY,1K,1%,1/16W,LPDB,GENERIC; WATTAGE: 1/16W; OriginalSymbolOrigin: (-25,75); XY: (-5550,1750); VER: 2; ROT: 0; PHYS_PAGE: 91; LOCATION: R9214; IP: GENERIC; FP_TECH: LPDB; DRAWING: @RVP1_ADL_SB_ADP_S_DDR5_SODIMM_2DPC_LIB.H55_DG2_2DPC(SCH_1):PAGE462; CDS_LIB: discrete; PCB Footprint: SMR0402IA; CHIPS_PART_NAME: RES; CDS_PART_NAME: RES_0402-A93548-023,EMPTY,1K,1%,1/16W,LPDB,GENERIC; CDS_LOCATION: R9214; ASI_MODEL: A93548-023
R9215 = RES: PART_NUMBER: A93548-023; CDS_PHYS_PART_NAME: RES_0402-A93548-023,EMPTY,1K,1%,1/16W,LPDB,GENERIC; WATTAGE: 1/16W; OriginalSymbolOrigin: (-25,75); XY: (-4925,2150); VER: 2; ROT: 0; PHYS_PAGE: 91; LOCATION: R9215; IP: GENERIC; FP_TECH: LPDB; DRAWING: @RVP1_ADL_SB_ADP_S_DDR5_SODIMM_2DPC_LIB.H55_DG2_2DPC(SCH_1):PAGE462; CDS_LIB: discrete; PCB Footprint: SMR0402IA; CHIPS_PART_NAME: RES; CDS_PART_NAME: RES_0402-A93548-023,EMPTY,1K,1%,1/16W,LPDB,GENERIC; CDS_LOCATION: R9215; ASI_MODEL: A93548-023
R9216 = RES: PART_NUMBER: A93548-023; CDS_PHYS_PART_NAME: RES_0402-A93548-023,EMPTY,1K,1%,1/16W,LPDB,GENERIC; WATTAGE: 1/16W; OriginalSymbolOrigin: (-25,75); XY: (-4925,1750); VER: 2; ROT: 0; PHYS_PAGE: 91; LOCATION: R9216; IP: GENERIC; FP_TECH: LPDB; DRAWING: @RVP1_ADL_SB_ADP_S_DDR5_SODIMM_2DPC_LIB.H55_DG2_2DPC(SCH_1):PAGE462; CDS_LIB: discrete; PCB Footprint: SMR0402IA; CHIPS_PART_NAME: RES; CDS_PART_NAME: RES_0402-A93548-023,EMPTY,1K,1%,1/16W,LPDB,GENERIC; CDS_LOCATION: R9216; ASI_MODEL: A93548-023

## Sheet 0093_M.2 KEY-E WLAN-BT.SchDoc
size A3
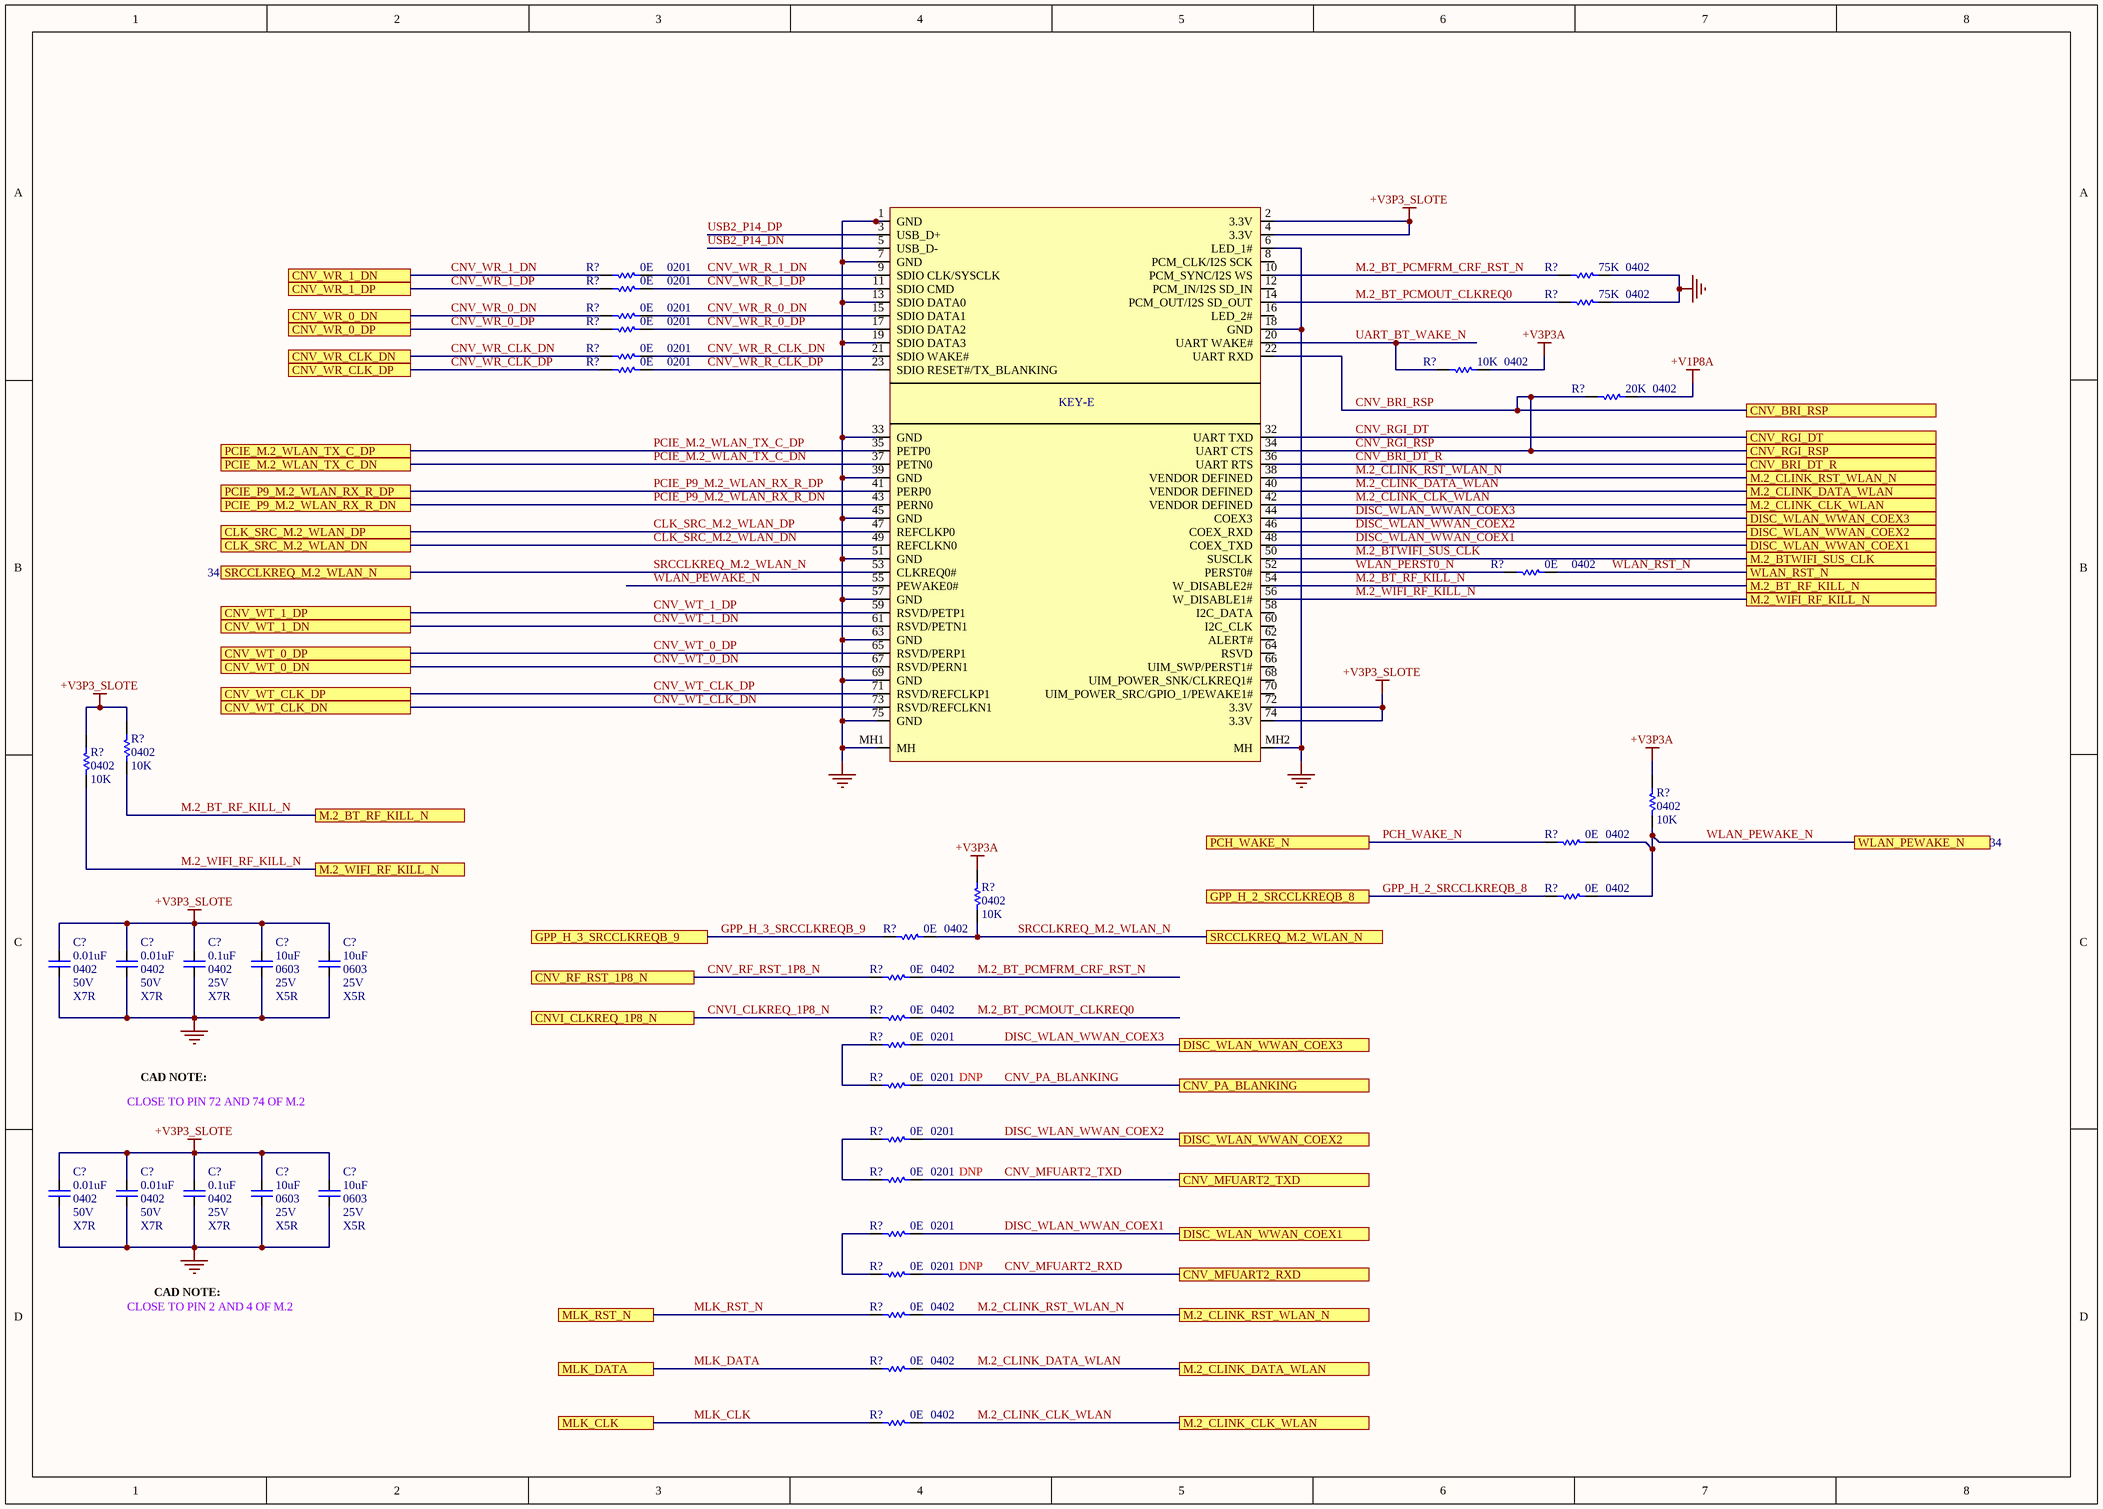
[diagram p160: 0093_M.2 KEY-E WLAN-BT.SchDoc]

### Parts
(Parts that share a designator on the sheet are numbered #1, #2 ... from top to bottom, then left to right.)
C?#225  value 0.01uF  Case/Package: 0402  Voltage: 50V  Dielectric: X7R  [CAPC0402]
C?#226  value 0.01uF  Case/Package: 0402  Voltage: 50V  Dielectric: X7R  [CAPC0402]
C?#227  value 0.1uF  Case/Package: 0402  Voltage: 25V  Dielectric: X7R  [CAPC0402]
C?#228  value 10uF  Case/Package: 0603  Voltage: 25V  Dielectric: X5R  [RESC0603]
C?#229  value 10uF  Case/Package: 0603  Voltage: 25V  Dielectric: X5R  [RESC0603]
C?#230  value 0.01uF  Case/Package: 0402  Voltage: 50V  Dielectric: X7R  [CAPC0402]
C?#231  value 0.01uF  Case/Package: 0402  Voltage: 50V  Dielectric: X7R  [CAPC0402]
C?#232  value 0.1uF  Case/Package: 0402  Voltage: 25V  Dielectric: X7R  [CAPC0402]
C?#233  value 10uF  Case/Package: 0603  Voltage: 25V  Dielectric: X5R  [RESC0603]
C?#234  value 10uF  Case/Package: 0603  Voltage: 25V  Dielectric: X5R  [RESC0603]
J?#11  C_M2_75P_KEYE_2EM  (value not drawn)
R?#373  value 0E  Case/Package: 0201  [RESC0201]  (hidden comment: Res)
R?#374  value 75K  Case/Package: 0402  [RESC0402]  (hidden comment: Res)
R?#375  value 0E  Case/Package: 0201  [RESC0201]  (hidden comment: Res)
R?#376  value 75K  Case/Package: 0402  [RESC0402]  (hidden comment: Res)
R?#377  value 0E  Case/Package: 0201  [RESC0201]  (hidden comment: Res)
R?#378  value 0E  Case/Package: 0201  [RESC0201]  (hidden comment: Res)
R?#379  value 0E  Case/Package: 0201  [RESC0201]  (hidden comment: Res)
R?#380  value 0E  Case/Package: 0201  [RESC0201]  (hidden comment: Res)
R?#381  value 10K  Case/Package: 0402  [RESC0402]  (hidden comment: Res)
R?#382  value 20K  Case/Package: 0402  [RESC0402]  (hidden comment: Res)
R?#383  value 0E  Case/Package: 0402  [RESC0402]  (hidden comment: Res)
R?#384  value 10K  Case/Package: 0402  [RESC0402]  (hidden comment: Res)
R?#385  value 10K  Case/Package: 0402  [RESC0402]  (hidden comment: Res)
R?#386  value 10K  Case/Package: 0402  [RESC0402]  (hidden comment: Res)
R?#387  value 0E  Case/Package: 0402  [RESC0402]  (hidden comment: Res)
R?#388  value 10K  Case/Package: 0402  [RESC0402]  (hidden comment: Res)
R?#389  value 0E  Case/Package: 0402  [RESC0402]  (hidden comment: Res)
R?#390  value 0E  Case/Package: 0402  [RESC0402]  (hidden comment: Res)
R?#391  value 0E  Case/Package: 0402  [RESC0402]  (hidden comment: Res)
R?#392  value 0E  Case/Package: 0402  [RESC0402]  (hidden comment: Res)
R?#393  value 0E  Case/Package: 0201  [RESC0201]  (hidden comment: Res)
R?#394  value 0E  Case/Package: 0201  [RESC0201]  (hidden comment: Res)
R?#395  value 0E  Case/Package: 0201  [RESC0201]  (hidden comment: Res)
R?#396  value 0E  Case/Package: 0201  [RESC0201]  (hidden comment: Res)
R?#397  value 0E  Case/Package: 0201  [RESC0201]  (hidden comment: Res)
R?#398  value 0E  Case/Package: 0201  [RESC0201]  (hidden comment: Res)
R?#399  value 0E  Case/Package: 0402  [RESC0402]  (hidden comment: Res)
R?#400  value 0E  Case/Package: 0402  [RESC0402]  (hidden comment: Res)
R?#401  value 0E  Case/Package: 0402  [RESC0402]  (hidden comment: Res)

### Ports
CLK_SRC_M.2_WLAN_DN, CLK_SRC_M.2_WLAN_DP, CNV_BRI_DT_R, CNV_BRI_RSP, CNV_MFUART2_RXD, CNV_MFUART2_TXD, CNV_PA_BLANKING, CNV_RF_RST_1P8_N, CNV_RGI_DT, CNV_RGI_RSP, CNV_WR_0_DN, CNV_WR_0_DP, CNV_WR_1_DN, CNV_WR_1_DP, CNV_WR_CLK_DN, CNV_WR_CLK_DP, CNV_WT_0_DN, CNV_WT_0_DP, CNV_WT_1_DN, CNV_WT_1_DP, CNV_WT_CLK_DN, CNV_WT_CLK_DP, CNVI_CLKREQ_1P8_N, DISC_WLAN_WWAN_COEX1, DISC_WLAN_WWAN_COEX2, DISC_WLAN_WWAN_COEX3, GPP_H_2_SRCCLKREQB_8, GPP_H_3_SRCCLKREQB_9, M.2_BT_RF_KILL_N, M.2_BTWIFI_SUS_CLK, M.2_CLINK_CLK_WLAN, M.2_CLINK_DATA_WLAN, M.2_CLINK_RST_WLAN_N, M.2_WIFI_RF_KILL_N, MLK_CLK, MLK_DATA, MLK_RST_N, PCH_WAKE_N, PCIE_M.2_WLAN_TX_C_DN, PCIE_M.2_WLAN_TX_C_DP, PCIE_P9_M.2_WLAN_RX_R_DN, PCIE_P9_M.2_WLAN_RX_R_DP, SRCCLKREQ_M.2_WLAN_N, WLAN_PEWAKE_N, WLAN_RST_N

### Nets
3P3V_2: J?#11.2(3P3V_2)
3P3V_4: J?#11.4(3P3V_4)
3P3V_72: J?#11.72(3P3V_72)
3P3V_74: J?#11.74(3P3V_74)
+V1P8A: R?#382.2
+V3P3_SLOTE: C?#225.2 C?#226.2 C?#227.2 C?#228.2 C?#229.2 C?#230.2 C?#231.2 C?#232.2 C?#233.2 C?#234.2 J?#11.2(3.3V) J?#11.4(3.3V) J?#11.72(3.3V) J?#11.74(3.3V) R?#384.2 R?#385.2
+V3P3A: R?#381.2 R?#386.2 R?#388.2
GND: C?#225.1 C?#226.1 C?#227.1 C?#228.1 C?#229.1 C?#230.1 C?#231.1 C?#232.1 C?#233.1 C?#234.1 J?#11.1(GND) J?#11.6(LED_1#) J?#11.7(GND) J?#11.13(SDIO_DATA0) J?#11.18(GND) J?#11.19(SDIO_DATA3) J?#11.33(GND) J?#11.39(GND) J?#11.45(GND) J?#11.51(GND) J?#11.57(GND) J?#11.63(GND) J?#11.69(GND) J?#11.75(GND) J?#11.MH1(MH) J?#11.MH2(MH) R?#374.2 R?#376.2  [project net EXP_A_RX_4_DP]
CLK_SRC_M.2_WLAN_DN: J?#11.49(REFCLKN0) ; port CLK_SRC_M.2_WLAN_DN
CLK_SRC_M.2_WLAN_DP: J?#11.47(REFCLKP0) ; port CLK_SRC_M.2_WLAN_DP
CNV_BRI_DT_R: J?#11.36(UART_RTS) ; port CNV_BRI_DT_R
CNV_BRI_RSP: J?#11.22(UART_RXD) J?#11.34(UART_CTS) R?#382.1 ; port CNV_BRI_RSP, port CNV_RGI_RSP  [also labelled CNV_RGI_RSP]
CNV_MFUART2_RXD: R?#398.1 ; port CNV_MFUART2_RXD
CNV_MFUART2_TXD: R?#396.1 ; port CNV_MFUART2_TXD
CNV_PA_BLANKING: R?#394.1 ; port CNV_PA_BLANKING
CNV_RF_RST_1P8_N: R?#391.2 ; port CNV_RF_RST_1P8_N
CNV_RGI_DT: J?#11.32(UART_TXD) ; port CNV_RGI_DT
CNV_WR_0_DN: R?#377.1 ; port CNV_WR_0_DN
CNV_WR_0_DP: R?#378.1 ; port CNV_WR_0_DP
CNV_WR_1_DN: R?#373.1 ; port CNV_WR_1_DN
CNV_WR_1_DP: R?#375.1 ; port CNV_WR_1_DP
CNV_WR_CLK_DN: R?#379.1 ; port CNV_WR_CLK_DN
CNV_WR_CLK_DP: R?#380.1 ; port CNV_WR_CLK_DP
CNV_WR_R_0_DN: J?#11.15(SDIO_DATA1) R?#377.2
CNV_WR_R_0_DP: J?#11.17(SDIO_DATA2) R?#378.2
CNV_WR_R_1_DN: J?#11.9(SDIO_CLK/SYSCLK) R?#373.2
CNV_WR_R_1_DP: J?#11.11(SDIO_CMD) R?#375.2
CNV_WR_R_CLK_DN: J?#11.21(SDIO_WAKE#) R?#379.2
CNV_WR_R_CLK_DP: J?#11.23(SDIO_RESET#/TX_BLANKING) R?#380.2
CNV_WT_0_DN: J?#11.67(RSVD/PERN1) ; port CNV_WT_0_DN
CNV_WT_0_DP: J?#11.65(RSVD/PERP1) ; port CNV_WT_0_DP
CNV_WT_1_DN: J?#11.61(RSVD/PETN1) ; port CNV_WT_1_DN
CNV_WT_1_DP: J?#11.59(RSVD/PETP1) ; port CNV_WT_1_DP
CNV_WT_CLK_DN: J?#11.73(RSVD/REFCLKN1) ; port CNV_WT_CLK_DN
CNV_WT_CLK_DP: J?#11.71(RSVD/REFCLKP1) ; port CNV_WT_CLK_DP
CNVI_CLKREQ_1P8_N: R?#392.2 ; port CNVI_CLKREQ_1P8_N
DISC_WLAN_WWAN_COEX1: J?#11.48(COEX_TXD) R?#397.1 ; port DISC_WLAN_WWAN_COEX1
DISC_WLAN_WWAN_COEX2: J?#11.46(COEX_RXD) R?#395.1 ; port DISC_WLAN_WWAN_COEX2
DISC_WLAN_WWAN_COEX3: J?#11.44(COEX3) R?#393.1 ; port DISC_WLAN_WWAN_COEX3
GPP_H_2_SRCCLKREQB_8: R?#389.2 ; port GPP_H_2_SRCCLKREQB_8
GPP_H_3_SRCCLKREQB_9: R?#390.2 ; port GPP_H_3_SRCCLKREQB_9
M.2_BT_PCMFRM_CRF_RST_N: J?#11.10(PCM_SYNC/I2S_WS) R?#374.1 R?#391.1
M.2_BT_PCMOUT_CLKREQ0: J?#11.14(PCM_OUT/I2S_SD_OUT) R?#376.1 R?#392.1
M.2_BT_RF_KILL_N: J?#11.54(W_DISABLE2#) R?#384.1 ; port M.2_BT_RF_KILL_N
M.2_BTWIFI_SUS_CLK: J?#11.50(SUSCLK) ; port M.2_BTWIFI_SUS_CLK
M.2_CLINK_CLK_WLAN: J?#11.42(VENDOR_DEFINED) R?#401.1 ; port M.2_CLINK_CLK_WLAN
M.2_CLINK_DATA_WLAN: J?#11.40(VENDOR_DEFINED) R?#400.1 ; port M.2_CLINK_DATA_WLAN
M.2_CLINK_RST_WLAN_N: J?#11.38(VENDOR_DEFINED) R?#399.1 ; port M.2_CLINK_RST_WLAN_N
M.2_WIFI_RF_KILL_N: J?#11.56(W_DISABLE1#) R?#385.1 ; port M.2_WIFI_RF_KILL_N
MLK_CLK: R?#401.2 ; port MLK_CLK
MLK_DATA: R?#400.2 ; port MLK_DATA
MLK_RST_N: R?#399.2 ; port MLK_RST_N
PCH_WAKE_N: R?#387.2 ; port PCH_WAKE_N
PCIE_M.2_WLAN_TX_C_DN: J?#11.37(PETN0) ; port PCIE_M.2_WLAN_TX_C_DN
PCIE_M.2_WLAN_TX_C_DP: J?#11.35(PETP0) ; port PCIE_M.2_WLAN_TX_C_DP
PCIE_P9_M.2_WLAN_RX_R_DN: J?#11.43(PERN0) ; port PCIE_P9_M.2_WLAN_RX_R_DN
PCIE_P9_M.2_WLAN_RX_R_DP: J?#11.41(PERP0) ; port PCIE_P9_M.2_WLAN_RX_R_DP
SRCCLKREQ_M.2_WLAN_N: J?#11.53(CLKREQ0#) R?#388.1 R?#390.1 ; port SRCCLKREQ_M.2_WLAN_N
UART_BT_WAKE_N: J?#11.20(UART_WAKE#) R?#381.1
USB2_P14_DN: J?#11.5(USB_D-)
USB2_P14_DP: J?#11.3(USB_D+)
WLAN_PERST0_N: J?#11.52(PERST0#) R?#383.1
WLAN_PEWAKE_N: J?#11.55(PEWAKE0#) R?#386.1 R?#387.1 R?#389.1 ; port WLAN_PEWAKE_N
WLAN_RST_N: R?#383.2 ; port WLAN_RST_N
NetR?#393_2: R?#393.2 R?#394.2
NetR?#395_2: R?#395.2 R?#396.2
NetR?#397_2: R?#397.2 R?#398.2

Not connected (* = marked no-connect by the designer): J?#11 8(PCM_CLK/I2S_SCK) 12(PCM_IN/I2S_SD_IN) 16(LED_2#) 58(I2C_DATA) 60(I2C_CLK) 62(ALERT#) 64(RSVD) 66(UIM_SWP/PERST1#) 68(UIM_POWER_SNK/CLKREQ1#) 70(UIM_POWER_SRC/GPIO_1/PEWAKE1#)

### Notes on the sheet
- CLOSE TO PIN 72 AND 74 OF M.2
- CAD NOTE:
- CLOSE TO PIN 2 AND 4 OF M.2
- (in symbol C_M2_75P_KEYE_2EM) KEY-E

### Library data of the parts
C?#225 C?#226 C?#230 C?#231 = Cap: CAP CER 0.01uF 50V X7R 0402
C?#227-C?#229 C?#232-C?#234 = Cap: CAP CER 0.1uF 50V X7R 0402
J?#11 = C_M2_75P_KEYE_2EM: CDS_LMAN_SYM_OUTLINE: -700,2100,700,-2100; ROOM: NONE; OriginalSymbolOrigin: (-750,2100); FP_TECH: ?; IP: ?; PACK_TYPE: ?; VARIANT: ?
R?#373 R?#375 R?#377-R?#380 R?#393-R?#398 = Res: Thick Film Resistor -  0ohm, 1%, 0201
  R?#394 R?#396 R?#398: DNP: DNP
R?#374 R?#376 = Res: Thick Film Resistor -  75Kohm, 1%, 0402
R?#381 R?#384-R?#386 R?#388 = Res: Thick Film Resistor -  10Kohm, 1%, 0402
R?#382 = Res: Thick Film Resistor -  20Kohm, 1%, 0402
R?#383 R?#387 R?#389-R?#392 R?#399-R?#401 = Res: Thick Film Resistor -  0ohm, 1%, 0402

## Sheet 0095_GBIT LAN - FOXVILLE LAN PHY CHIP.SchDoc
size A3
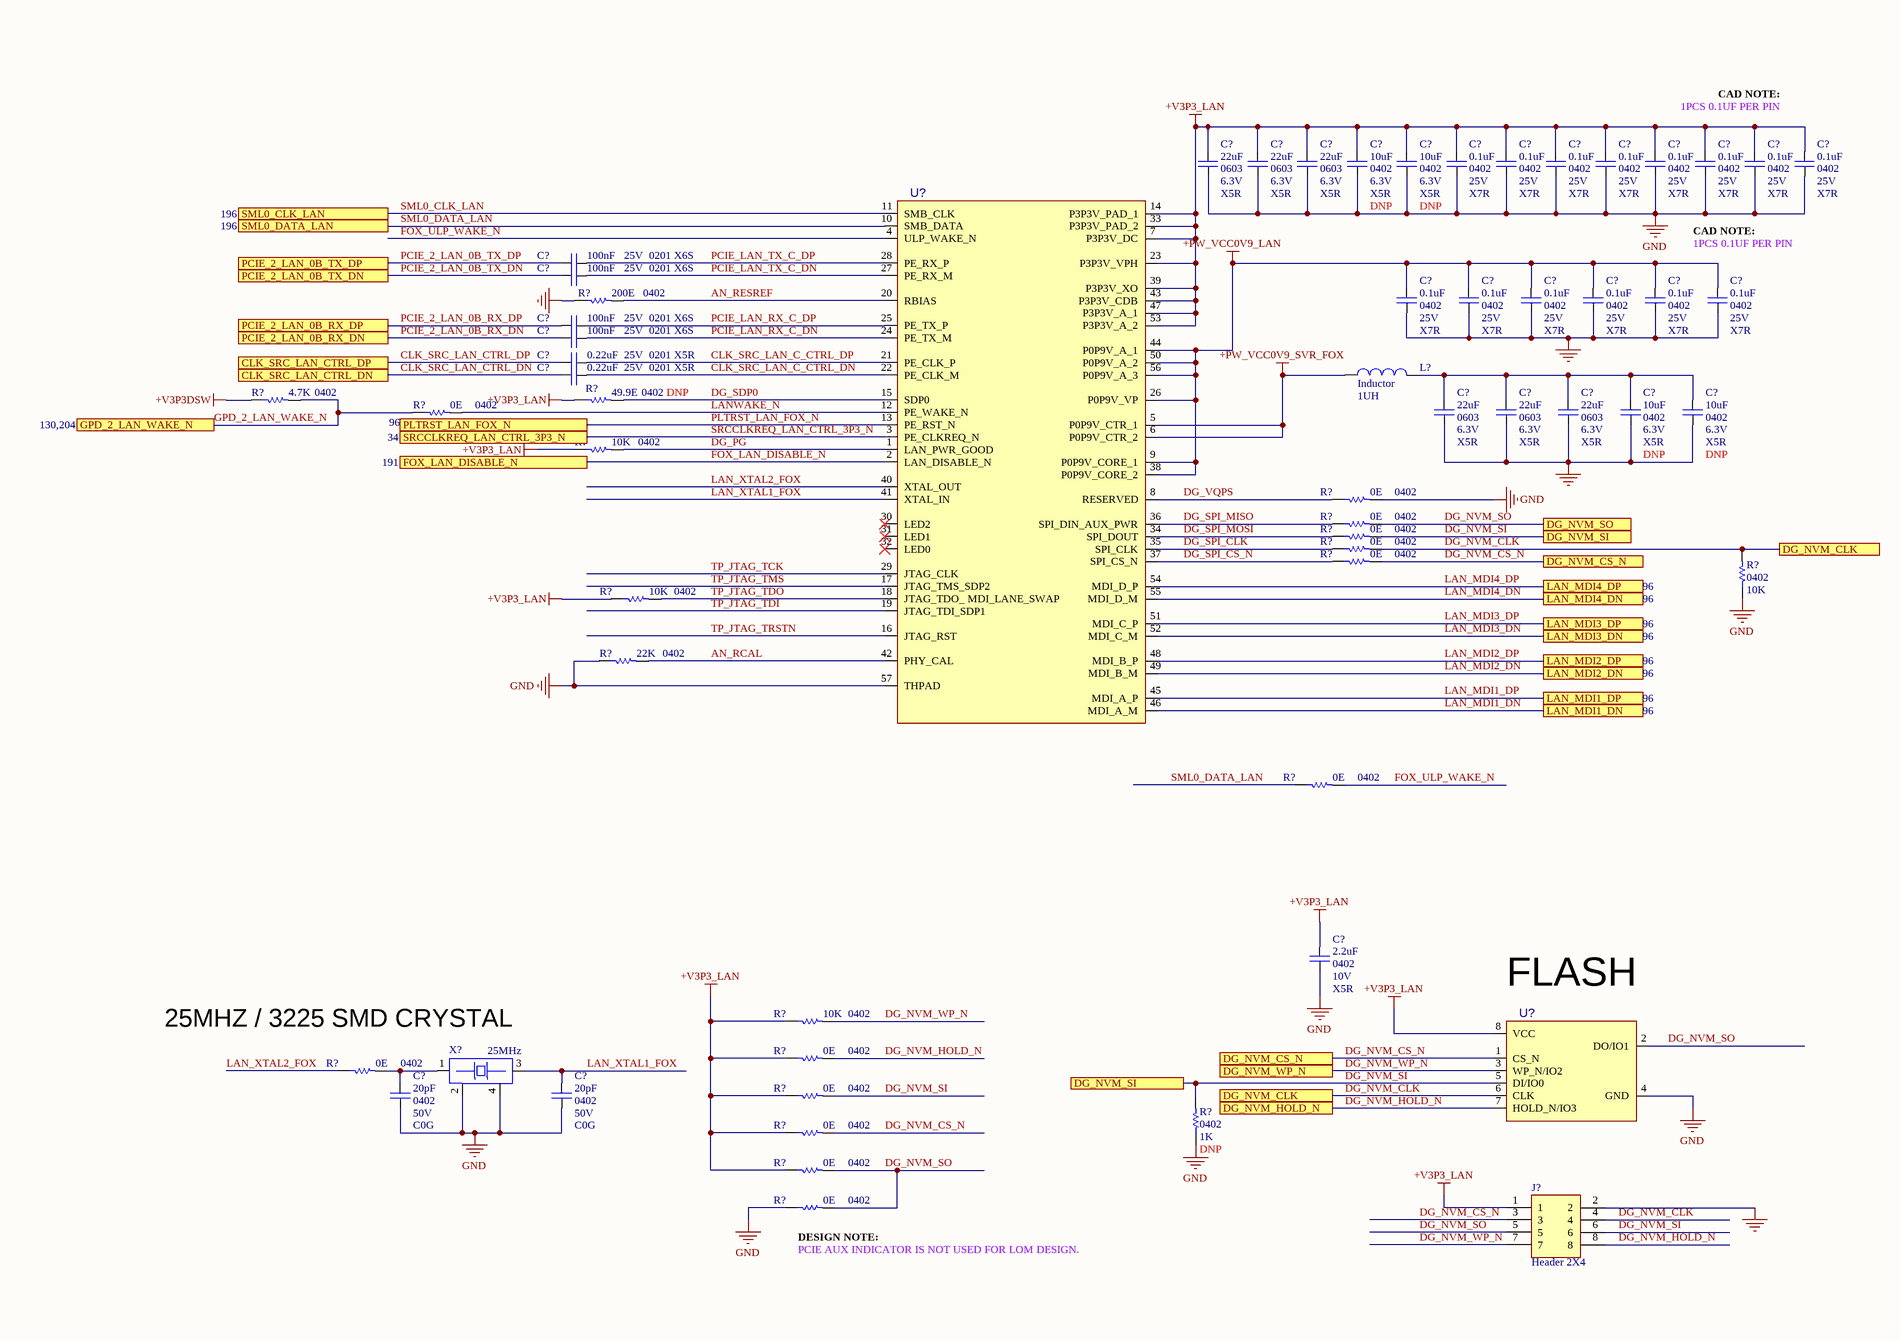
[diagram p161: 0095_GBIT LAN - FOXVILLE LAN PHY CHIP.SchDoc, bottom left]

### Parts
(Parts that share a designator on the sheet are numbered #1, #2 ... from top to bottom, then left to right.)
C?#235  value 22uF  Case/Package: 0603  Voltage: 6.3V  Dielectric: X5R  [CAPC0603]
C?#236  value 22uF  Case/Package: 0603  Voltage: 6.3V  Dielectric: X5R  [CAPC0603]
C?#237  value 22uF  Case/Package: 0603  Voltage: 6.3V  Dielectric: X5R  [CAPC0603]
C?#238  value 10uF  Case/Package: 0402  Voltage: 6.3V  Dielectric: X5R  [CAPC0402]
C?#239  value 10uF  Case/Package: 0402  Voltage: 6.3V  Dielectric: X5R  [CAPC0402]
C?#240  value 0.1uF  Case/Package: 0402  Voltage: 25V  Dielectric: X7R  [CAPC0402]
C?#241  value 0.1uF  Case/Package: 0402  Voltage: 25V  Dielectric: X7R  [CAPC0402]
C?#242  value 0.1uF  Case/Package: 0402  Voltage: 25V  Dielectric: X7R  [CAPC0402]
C?#243  value 0.1uF  Case/Package: 0402  Voltage: 25V  Dielectric: X7R  [CAPC0402]
C?#244  value 0.1uF  Case/Package: 0402  Voltage: 25V  Dielectric: X7R  [CAPC0402]
C?#245  value 0.1uF  Case/Package: 0402  Voltage: 25V  Dielectric: X7R  [CAPC0402]
C?#246  value 0.1uF  Case/Package: 0402  Voltage: 25V  Dielectric: X7R  [CAPC0402]
C?#247  value 0.1uF  Case/Package: 0402  Voltage: 25V  Dielectric: X7R  [CAPC0402]
C?#248  value 100nF  Case/Package: 0201  Voltage: 25V  Dielectric: X6S  [CAPC0201]
C?#249  value 100nF  Case/Package: 0201  Voltage: 25V  Dielectric: X6S  [CAPC0201]
C?#250  value 0.1uF  Case/Package: 0402  Voltage: 25V  Dielectric: X7R  [CAPC0402]
C?#251  value 0.1uF  Case/Package: 0402  Voltage: 25V  Dielectric: X7R  [CAPC0402]
C?#252  value 0.1uF  Case/Package: 0402  Voltage: 25V  Dielectric: X7R  [CAPC0402]
C?#253  value 0.1uF  Case/Package: 0402  Voltage: 25V  Dielectric: X7R  [CAPC0402]
C?#254  value 0.1uF  Case/Package: 0402  Voltage: 25V  Dielectric: X7R  [CAPC0402]
C?#255  value 0.1uF  Case/Package: 0402  Voltage: 25V  Dielectric: X7R  [CAPC0402]
C?#256  value 100nF  Case/Package: 0201  Voltage: 25V  Dielectric: X6S  [CAPC0201]
C?#257  value 100nF  Case/Package: 0201  Voltage: 25V  Dielectric: X6S  [CAPC0201]
C?#258  value 0.22uF  Case/Package: 0201  Voltage: 25V  Dielectric: X5R  [CAPC0201]
C?#259  value 0.22uF  Case/Package: 0201  Voltage: 25V  Dielectric: X5R  [CAPC0201]
C?#260  value 22uF  Case/Package: 0603  Voltage: 6.3V  Dielectric: X5R  [CAPC0603]
C?#261  value 22uF  Case/Package: 0603  Voltage: 6.3V  Dielectric: X5R  [CAPC0603]
C?#262  value 22uF  Case/Package: 0603  Voltage: 6.3V  Dielectric: X5R  [CAPC0603]
C?#263  value 10uF  Case/Package: 0402  Voltage: 6.3V  Dielectric: X5R  [CAPC0402]
C?#264  value 10uF  Case/Package: 0402  Voltage: 6.3V  Dielectric: X5R  [CAPC0402]
C?#265  value 2.2uF  Case/Package: 0402  Voltage: 10V  Dielectric: X5R  [CAPC0402]
C?#266  value 20pF  Case/Package: 0402  Voltage: 50V  Dielectric: C0G  [CAPC0402]
C?#267  value 20pF  Case/Package: 0402  Voltage: 50V  Dielectric: C0G  [CAPC0402]
J?#12  Header 2X4  [Header 2X4]
L?  Inductor  value 1UH
R?#402  value 200E  Case/Package: 0402  [RESC0402]  (hidden comment: Res)
R?#403  value 4.7K  Case/Package: 0402  [RESC0402]  (hidden comment: Res)
R?#404  value 49.9E  Case/Package: 0402  [RESC0402]  (hidden comment: Res)
R?#405  value 0E  Case/Package: 0402  [RESC0402]  (hidden comment: Res)
R?#406  value 10K  Case/Package: 0402  [RESC0402]  (hidden comment: Res)
R?#407  value 0E  Case/Package: 0402  [RESC0402]  (hidden comment: Res)
R?#408  value 0E  Case/Package: 0402  [RESC0402]  (hidden comment: Res)
R?#409  value 0E  Case/Package: 0402  [RESC0402]  (hidden comment: Res)
R?#410  value 0E  Case/Package: 0402  [RESC0402]  (hidden comment: Res)
R?#411  value 0E  Case/Package: 0402  [RESC0402]  (hidden comment: Res)
R?#412  value 10K  Case/Package: 0402  [RESC0402]  (hidden comment: Res)
R?#413  value 10K  Case/Package: 0402  [RESC0402]  (hidden comment: Res)
R?#414  value 22K  Case/Package: 0402  [RESC0402]  (hidden comment: Res)
R?#415  value 0E  Case/Package: 0402  [RESC0402]  (hidden comment: Res)
R?#416  value 10K  Case/Package: 0402  [RESC0402]  (hidden comment: Res)
R?#417  value 0E  Case/Package: 0402  [RESC0402]  (hidden comment: Res)
R?#418  value 0E  Case/Package: 0402  [RESC0402]  (hidden comment: Res)
R?#419  value 0E  Case/Package: 0402  [RESC0402]  (hidden comment: Res)
R?#420  value 1K  Case/Package: 0402  [RESC0402]  (hidden comment: Res)
R?#421  value 0E  Case/Package: 0402  [RESC0402]  (hidden comment: Res)
R?#422  value 0E  Case/Package: 0402  [RESC0402]  (hidden comment: Res)
R?#423  value 0E  Case/Package: 0402  [RESC0402]  (hidden comment: Res)
U?#7  FOXVILLE_IP  (value not drawn)
U?#8  W25Q16  (value not drawn)
X?#2  value 25MHz  (hidden comment: CRYSTAL_1)

### Ports
CLK_SRC_LAN_CTRL_DN, CLK_SRC_LAN_CTRL_DP, DG_NVM_CLK, DG_NVM_CS_N, DG_NVM_HOLD_N, DG_NVM_SI, DG_NVM_SO, DG_NVM_WP_N, FOX_LAN_DISABLE_N, GPD_2_LAN_WAKE_N, LAN_MDI1_DN, LAN_MDI1_DP, LAN_MDI2_DN, LAN_MDI2_DP, LAN_MDI3_DN, LAN_MDI3_DP, LAN_MDI4_DN, LAN_MDI4_DP, PCIE_2_LAN_0B_RX_DN, PCIE_2_LAN_0B_RX_DP, PCIE_2_LAN_0B_TX_DN, PCIE_2_LAN_0B_TX_DP, PLTRST_LAN_FOX_N, SML0_CLK_LAN, SML0_DATA_LAN, SRCCLKREQ_LAN_CTRL_3P3_N

### Nets
+PW_VCC0V9_LAN: C?#250.2 C?#251.2 C?#252.2 C?#253.2 C?#254.2 C?#255.2 U?#7.9(P0P9V_CORE_1) U?#7.26(P0P9V_VP) U?#7.38(P0P9V_CORE_2) U?#7.44(P0P9V_A_1) U?#7.50(P0P9V_A_2) U?#7.56(P0P9V_A_3)
+PW_VCC0V9_SVR_FOX: L?.1 U?#7.5(P0P9V_CTR_1) U?#7.6(P0P9V_CTR_2)
+V3P3_LAN: C?#235.2 C?#236.2 C?#237.2 C?#238.2 C?#239.2 C?#240.2 C?#241.2 C?#242.2 C?#243.2 C?#244.2 C?#245.2 C?#246.2 C?#247.2 C?#265.2 J?#12.1 R?#404.1 R?#406.1 R?#413.1 R?#416.1 R?#417.1 R?#419.1 R?#421.1 R?#422.1 U?#7.7(P3P3V_DC) U?#7.14(P3P3V_PAD_1) U?#7.23(P3P3V_VPH) U?#7.33(P3P3V_PAD_2) U?#7.39(P3P3V_XO) U?#7.43(P3P3V_CDB) U?#7.47(P3P3V_A_1) U?#7.53(P3P3V_A_2) U?#8.8(VCC)
+V3P3DSW: R?#403.1
GND: C?#235.1 C?#236.1 C?#237.1 C?#238.1 C?#239.1 C?#240.1 C?#241.1 C?#242.1 C?#243.1 C?#244.1 C?#245.1 C?#246.1 C?#247.1 C?#250.1 C?#251.1 C?#252.1 C?#253.1 C?#254.1 C?#255.1 C?#260.1 C?#261.1 C?#262.1 C?#263.1 C?#264.1 C?#265.1 C?#266.1 C?#267.1 J?#12.2 R?#402.1 R?#407.2 R?#412.1 R?#414.1 R?#420.1 R?#423.1 U?#7.57(THPAD) U?#8.4(GND) X?#2.2 X?#2.4  [project net EXP_A_RX_4_DP]
P0P9V_A_1: U?#7.44(P0P9V_A_1)
P0P9V_A_2: U?#7.50(P0P9V_A_2)
P0P9V_A_3: U?#7.56(P0P9V_A_3)
P0P9V_CORE_1: U?#7.9(P0P9V_CORE_1)
P0P9V_CORE_2: U?#7.38(P0P9V_CORE_2)
P0P9V_VP: U?#7.26(P0P9V_VP)
P3P3V_A_1: U?#7.47(P3P3V_A_1)
P3P3V_A_2: U?#7.53(P3P3V_A_2)
P3P3V_CDB: U?#7.43(P3P3V_CDB)
P3P3V_DC: U?#7.7(P3P3V_DC)
P3P3V_PAD_1: U?#7.14(P3P3V_PAD_1)
P3P3V_PAD_2: U?#7.33(P3P3V_PAD_2)
P3P3V_VPH: U?#7.23(P3P3V_VPH)
P3P3V_XO: U?#7.39(P3P3V_XO)
RESERVED: U?#7.8(RESERVED)
VCC: U?#8.8(VCC)
AN_RCAL: R?#414.2 U?#7.42(PHY_CAL)
AN_RESREF: R?#402.2 U?#7.20(RBIAS)
CLK_SRC_LAN_C_CTRL_DN: C?#259.2 U?#7.22(PE_CLK_M)
CLK_SRC_LAN_C_CTRL_DP: C?#258.2 U?#7.21(PE_CLK_P)
CLK_SRC_LAN_CTRL_DN: C?#259.1 ; port CLK_SRC_LAN_CTRL_DN
CLK_SRC_LAN_CTRL_DP: C?#258.1 ; port CLK_SRC_LAN_CTRL_DP
DG_NVM_CLK: J?#12.4 R?#410.2 R?#412.2 U?#8.6(CLK) ; port DG_NVM_CLK
DG_NVM_CS_N: J?#12.3 R?#411.2 R?#421.2 U?#8.1(CS_N) ; port DG_NVM_CS_N
DG_NVM_HOLD_N: J?#12.8 R?#417.2 U?#8.7(HOLD_N/IO3) ; port DG_NVM_HOLD_N
DG_NVM_SI: J?#12.6 R?#409.2 R?#419.2 R?#420.2 U?#8.5(DI/IO0) ; port DG_NVM_SI
DG_NVM_SO: J?#12.5 R?#408.2 R?#422.2 R?#423.2 U?#8.2(DO/IO1) ; port DG_NVM_SO
DG_NVM_WP_N: J?#12.7 R?#416.2 U?#8.3(WP_N/IO2) ; port DG_NVM_WP_N
DG_PG: R?#406.2 U?#7.1(LAN_PWR_GOOD)
DG_SDP0: R?#404.2 U?#7.15(SDP0)
DG_SPI_CLK: R?#410.1 U?#7.35(SPI_CLK)
DG_SPI_CS_N: R?#411.1 U?#7.37(SPI_CS_N)
DG_SPI_MISO: R?#408.1 U?#7.36(SPI_DIN_AUX_PWR)
DG_SPI_MOSI: R?#409.1 U?#7.34(SPI_DOUT)
DG_VQPS: R?#407.1 U?#7.8(RESERVED)
FOX_LAN_DISABLE_N: U?#7.2(LAN_DISABLE_N) ; port FOX_LAN_DISABLE_N
FOX_ULP_WAKE_N: R?#415.2 U?#7.4(ULP_WAKE_N)
GPD_2_LAN_WAKE_N: R?#403.2 R?#405.1 ; port GPD_2_LAN_WAKE_N
LAN_MDI1_DN: U?#7.46(MDI_A_M) ; port LAN_MDI1_DN
LAN_MDI1_DP: U?#7.45(MDI_A_P) ; port LAN_MDI1_DP
LAN_MDI2_DN: U?#7.49(MDI_B_M) ; port LAN_MDI2_DN
LAN_MDI2_DP: U?#7.48(MDI_B_P) ; port LAN_MDI2_DP
LAN_MDI3_DN: U?#7.52(MDI_C_M) ; port LAN_MDI3_DN
LAN_MDI3_DP: U?#7.51(MDI_C_P) ; port LAN_MDI3_DP
LAN_MDI4_DN: U?#7.55(MDI_D_M) ; port LAN_MDI4_DN
LAN_MDI4_DP: U?#7.54(MDI_D_P) ; port LAN_MDI4_DP
LAN_XTAL1_FOX: C?#267.2 U?#7.41(XTAL_IN) X?#2.3
LAN_XTAL2_FOX: R?#418.1 U?#7.40(XTAL_OUT)
LANWAKE_N: R?#405.2 U?#7.12(PE_WAKE_N)
PCIE_2_LAN_0B_RX_DN: C?#257.1 ; port PCIE_2_LAN_0B_RX_DN
PCIE_2_LAN_0B_RX_DP: C?#256.1 ; port PCIE_2_LAN_0B_RX_DP
PCIE_2_LAN_0B_TX_DN: C?#249.1 ; port PCIE_2_LAN_0B_TX_DN
PCIE_2_LAN_0B_TX_DP: C?#248.1 ; port PCIE_2_LAN_0B_TX_DP
PCIE_LAN_RX_C_DN: C?#257.2 U?#7.24(PE_TX_M)
PCIE_LAN_RX_C_DP: C?#256.2 U?#7.25(PE_TX_P)
PCIE_LAN_TX_C_DN: C?#249.2 U?#7.27(PE_RX_M)
PCIE_LAN_TX_C_DP: C?#248.2 U?#7.28(PE_RX_P)
PLTRST_LAN_FOX_N: U?#7.13(PE_RST_N) ; port PLTRST_LAN_FOX_N
SML0_CLK_LAN: U?#7.11(SMB_CLK) ; port SML0_CLK_LAN
SML0_DATA_LAN: R?#415.1 U?#7.10(SMB_DATA) ; port SML0_DATA_LAN
SRCCLKREQ_LAN_CTRL_3P3_N: U?#7.3(PE_CLKREQ_N) ; port SRCCLKREQ_LAN_CTRL_3P3_N  [project net PCIEX16_PRSNT2_N]
TP_JTAG_TCK: U?#7.29(JTAG_CLK)
TP_JTAG_TDI: U?#7.19(JTAG_TDI_SDP1)
TP_JTAG_TDO: R?#413.2 U?#7.18(JTAG_TDO__MDI_LANE_SWAP)
TP_JTAG_TMS: U?#7.17(JTAG_TMS_SDP2)
TP_JTAG_TRSTN: U?#7.16(JTAG_RST)
NetC?#260_2: C?#260.2 C?#261.2 C?#262.2 C?#263.2 C?#264.2 L?.2
NetC?#266_2: C?#266.2 R?#418.2 X?#2.1

Not connected (* = marked no-connect by the designer): U?#7 30(LED2)* 31(LED1)* 32(LED0)*

### Notes on the sheet
- (near C?#245) 1PCS 0.1UF PER PIN
- CAD NOTE:
- (near C?#255) 1PCS 0.1UF PER PIN
- (near U?#8) FLASH
- 25MHZ / 3225 SMD CRYSTAL
- (near R?#423) DESIGN NOTE:
- (near R?#423) PCIE AUX INDICATOR IS NOT USED FOR LOM DESIGN.

### Library data of the parts
C?#235-C?#237 C?#260-C?#262 = Cap: CAP CER 22uF 6.3V X5R 0603
C?#238 C?#239 C?#263 C?#264 = Cap: CAP CER 10uF 6.3V X5R 0402; DNP: DNP
C?#240-C?#247 C?#250-C?#255 = Cap: CAP CER 0.1uF 25V X7R 0402
C?#248 C?#249 C?#256 C?#257 = Cap: CAP CER 100nF 25V X6S 0201
C?#258 C?#259 = Cap: CAP CER 0.22uF 25V X5R 0201
C?#265 = Cap: CAP CER 2.2uF 10V X5R 0402
C?#266 C?#267 = Cap: CAP CER 20pF 50V C0G 0402
J?#12 = Header 2X4: Headers & Wire Housings ECONOSTIK HEADER DR VT TH 2X4; Manufacturer Part Number: 10129381-908002BLF; Case/Package: TH
R?#402 = Res: Thick Film Resistor -  200ohm, 1%, 0402
R?#403 = Res: Thick Film Resistor -  4.7Kohm, 1%, 0402
R?#404 = Res: Thick Film Resistor -  49.9ohm, 1%, 0402; DNP: DNP
R?#405 R?#407-R?#411 R?#415 R?#417-R?#419 R?#421-R?#423 = Res: Thick Film Resistor -  0ohm, 1%, 0402
R?#406 R?#412 R?#413 R?#416 = Res: Thick Film Resistor -  10Kohm, 1%, 0402
R?#414 = Res: Thick Film Resistor -  22Kohm, 1%, 0402
R?#420 = Res: Thick Film Resistor -  1Kohm, 1%, 0402; DNP: DNP
U?#7 = FOXVILLE_IP: CDS_LMAN_SYM_OUTLINE: -500,1100,500,-1100; OriginalSymbolOrigin: (-550,1100); PACK_TYPE: ?
U?#8 = W25Q16: OriginalSymbolOrigin: (-350,250); PACK_TYPE: ?
L? = Inductor: Manufacturer Part Number: *; Case/Package: *
X?#2 = CRYSTAL_1: Manufacturer_Part_Number: *; Case/Package: *

## Sheet 0096_CONNECTIVITY - FOX.SchDoc
size A3
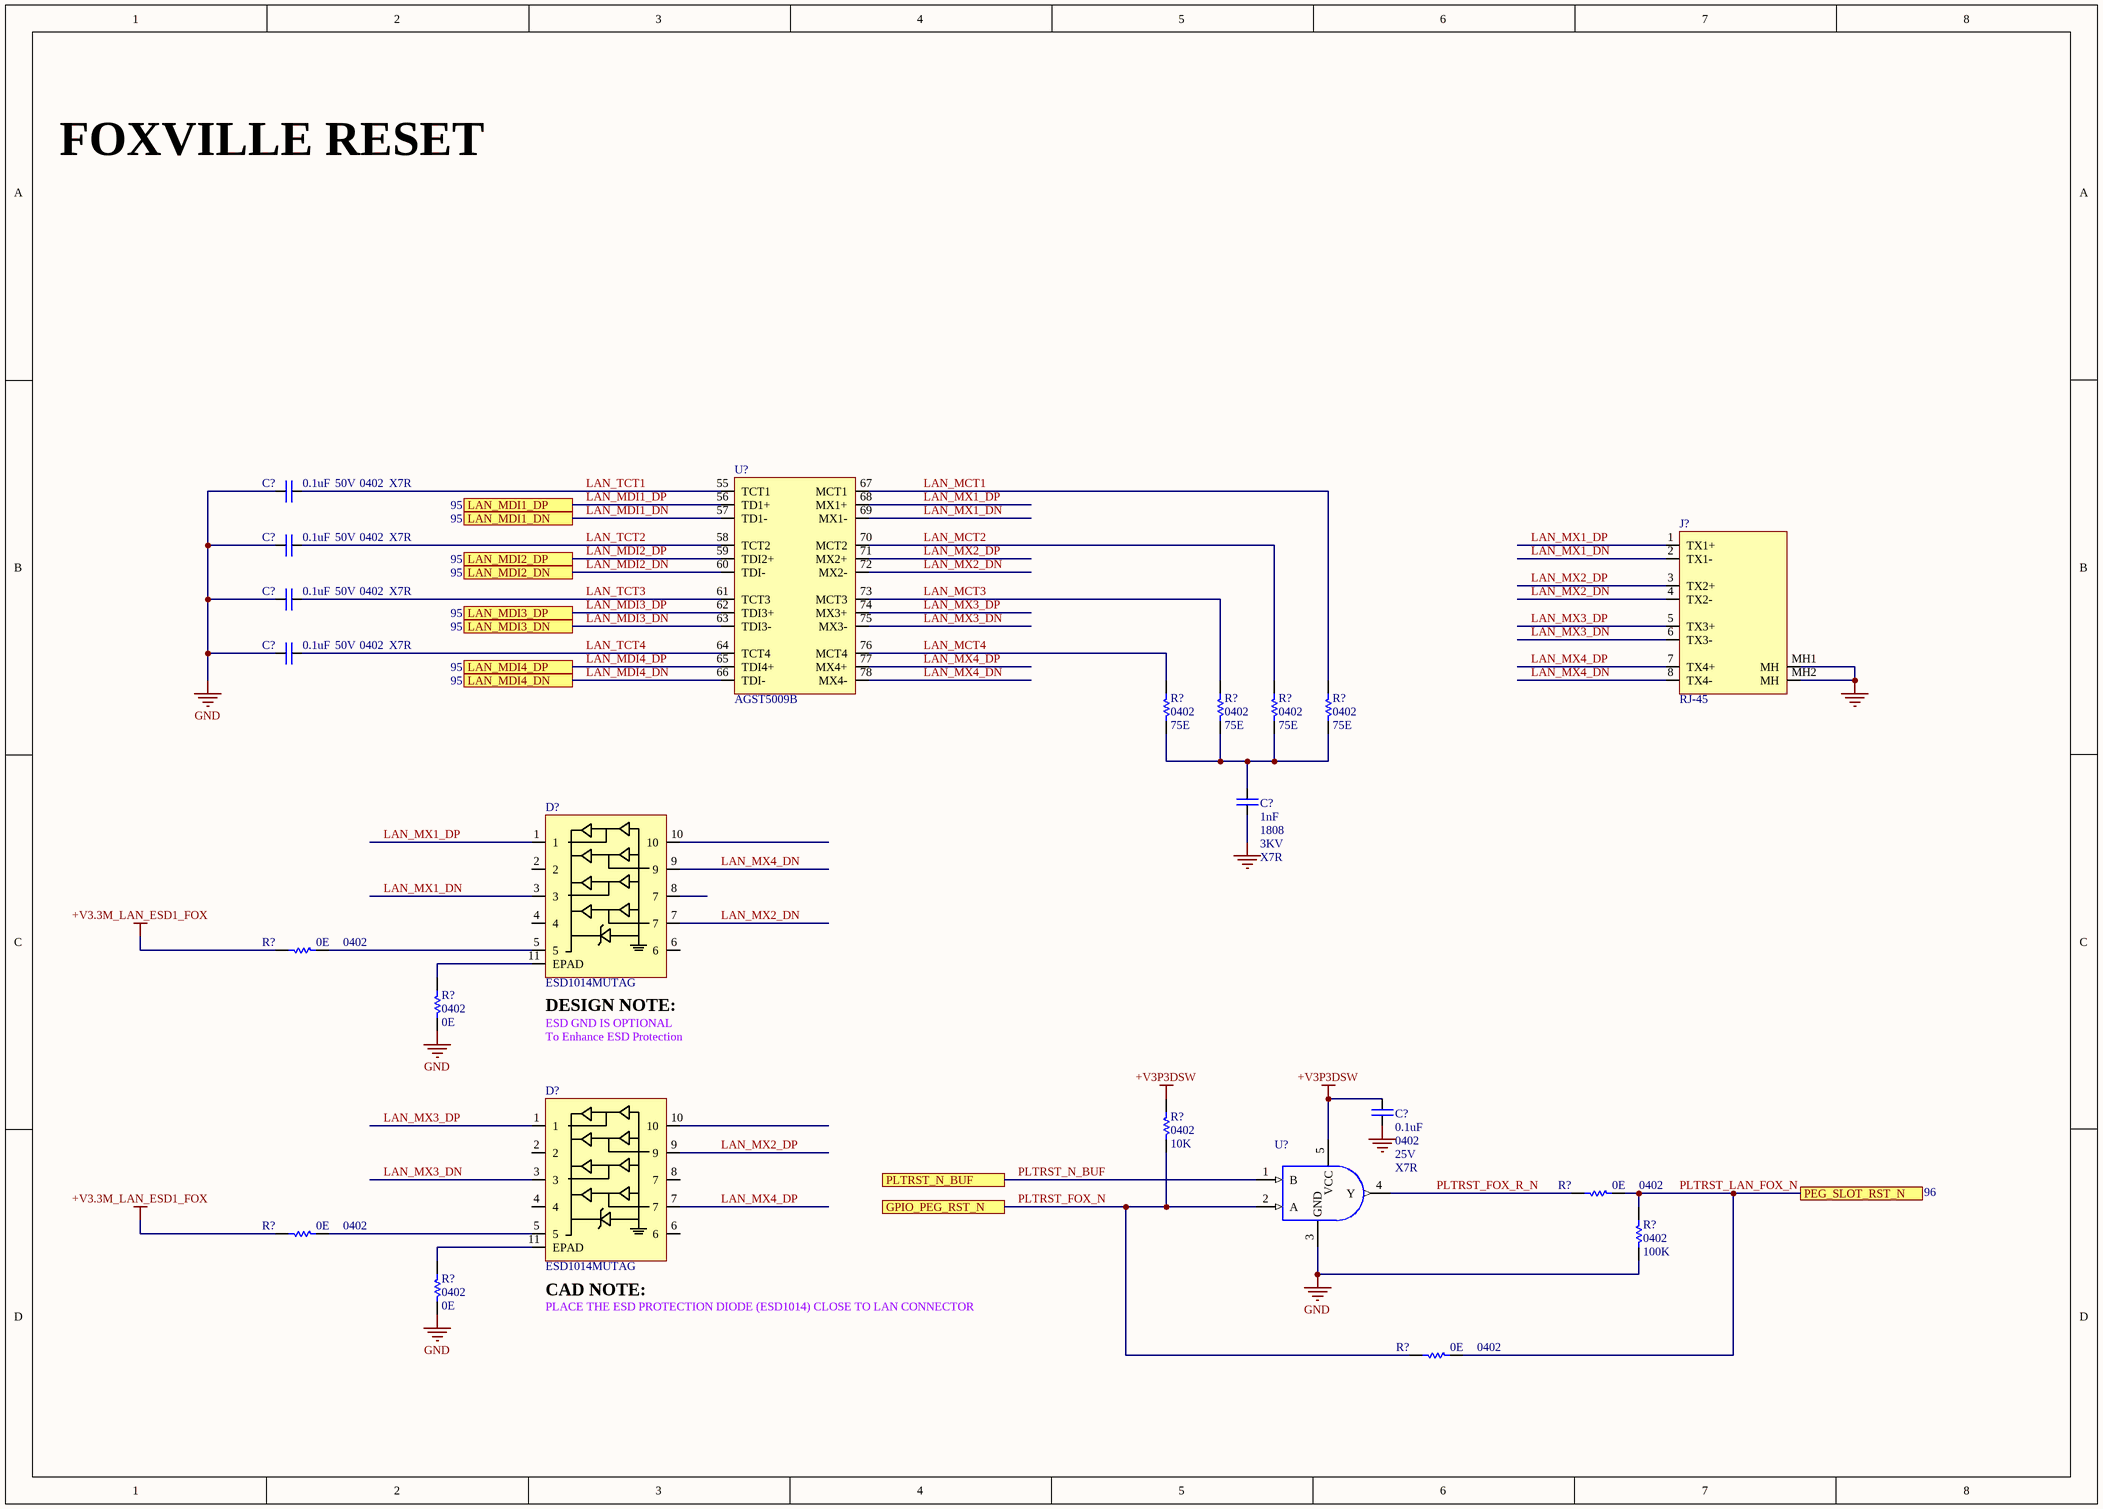
[diagram p162: 0096_CONNECTIVITY - FOX.SchDoc]

### Parts
(Parts that share a designator on the sheet are numbered #1, #2 ... from top to bottom, then left to right.)
C?#268  value 0.1uF  Case/Package: 0402  Voltage: 50V  Dielectric: X7R  [CAPC0402]
C?#269  value 0.1uF  Case/Package: 0402  Voltage: 50V  Dielectric: X7R  [CAPC0402]
C?#270  value 0.1uF  Case/Package: 0402  Voltage: 50V  Dielectric: X7R  [CAPC0402]
C?#271  value 0.1uF  Case/Package: 0402  Voltage: 50V  Dielectric: X7R  [CAPC0402]
C?#272  value 1nF  Case/Package: 1808  Voltage: 3KV  Dielectric: X7R
C?#273  value 0.1uF  Case/Package: 0402  Voltage: 25V  Dielectric: X7R  [CAPC0402]
D?#47  ESD1014MUTAG
D?#48  ESD1014MUTAG
J?#13  RJ-45
R?#424  value 75E  Case/Package: 0402  [RESC0402]  (hidden comment: Res)
R?#425  value 75E  Case/Package: 0402  [RESC0402]  (hidden comment: Res)
R?#426  value 75E  Case/Package: 0402  [RESC0402]  (hidden comment: Res)
R?#427  value 75E  Case/Package: 0402  [RESC0402]  (hidden comment: Res)
R?#428  value 0E  Case/Package: 0402  [RESC0402]  (hidden comment: Res)
R?#429  value 0E  Case/Package: 0402  [RESC0402]  (hidden comment: Res)
R?#430  value 10K  Case/Package: 0402  [RESC0402]  (hidden comment: Res)
R?#431  value 0E  Case/Package: 0402  [RESC0402]  (hidden comment: Res)
R?#432  value 0E  Case/Package: 0402  [RESC0402]  (hidden comment: Res)
R?#433  value 100K  Case/Package: 0402  [RESC0402]  (hidden comment: Res)
R?#434  value 0E  Case/Package: 0402  [RESC0402]  (hidden comment: Res)
R?#435  value 0E  Case/Package: 0402  [RESC0402]  (hidden comment: Res)
U?#9  AGST5009B
U?#10  74AHC1G08GW,125  [SOT353]  (value not drawn)

### Ports
GPIO_PEG_RST_N, LAN_MDI1_DN, LAN_MDI1_DP, LAN_MDI2_DN, LAN_MDI2_DP, LAN_MDI3_DN, LAN_MDI3_DP, LAN_MDI4_DN, LAN_MDI4_DP, PEG_SLOT_RST_N, PLTRST_N_BUF

### Nets
+V3.3M_LAN_ESD1_FOX: R?#428.1 R?#432.1
+V3P3DSW: C?#273.1 R?#430.2 U?#10.5(VCC)
GND: C?#268.1 C?#269.1 C?#270.1 C?#271.1 C?#272.1 C?#273.2 J?#13.MH1(MH) J?#13.MH2(MH) R?#429.1 R?#433.1 R?#434.1 U?#10.3(GND)  [project net EXP_A_RX_4_DP]
LAN_MCT1: R?#427.2 U?#9.67(MCT1)
LAN_MCT2: R?#426.2 U?#9.70(MCT2)
LAN_MCT3: R?#425.2 U?#9.73(MCT3)
LAN_MCT4: R?#424.2 U?#9.76(MCT4)
LAN_MDI1_DN: U?#9.57(TD1-) ; port LAN_MDI1_DN
LAN_MDI1_DP: U?#9.56(TD1+) ; port LAN_MDI1_DP
LAN_MDI2_DN: U?#9.60(TDI-) ; port LAN_MDI2_DN
LAN_MDI2_DP: U?#9.59(TDI2+) ; port LAN_MDI2_DP
LAN_MDI3_DN: U?#9.63(TDI3-) ; port LAN_MDI3_DN
LAN_MDI3_DP: U?#9.62(TDI3+) ; port LAN_MDI3_DP
LAN_MDI4_DN: U?#9.66(TDI-) ; port LAN_MDI4_DN
LAN_MDI4_DP: U?#9.65(TDI4+) ; port LAN_MDI4_DP
LAN_MX1_DN: D?#47.3 J?#13.2(TX1-) U?#9.69(MX1-)
LAN_MX1_DP: D?#47.1 J?#13.1(TX1+) U?#9.68(MX1+)
LAN_MX2_DN: D?#47.7 J?#13.4(TX2-) U?#9.72(MX2-)
LAN_MX2_DP: D?#48.9 J?#13.3(TX2+) U?#9.71(MX2+)
LAN_MX3_DN: D?#48.3 J?#13.6(TX3-) U?#9.75(MX3-)
LAN_MX3_DP: D?#48.1 J?#13.5(TX3+) U?#9.74(MX3+)
LAN_MX4_DN: D?#47.9 J?#13.8(TX4-) U?#9.78(MX4-)
LAN_MX4_DP: D?#48.7 J?#13.7(TX4+) U?#9.77(MX4+)
LAN_TCT1: C?#268.2 U?#9.55(TCT1)
LAN_TCT2: C?#269.2 U?#9.58(TCT2)
LAN_TCT3: C?#270.2 U?#9.61(TCT3)
LAN_TCT4: C?#271.2 U?#9.64(TCT4)
PLTRST_FOX_N: R?#430.1 R?#435.1 U?#10.2(A) ; port GPIO_PEG_RST_N  [project net GPIO_PEG_RST_N]
PLTRST_FOX_R_N: R?#431.1 U?#10.4(Y)
PLTRST_LAN_FOX_N: R?#431.2 R?#433.2 R?#435.2 ; port PEG_SLOT_RST_N  [project net PEG_SLOT_RST_N]
PLTRST_N_BUF: U?#10.1(B) ; port PLTRST_N_BUF
NetC?#272_2: C?#272.2 R?#424.1 R?#425.1 R?#426.1 R?#427.1
NetD?#47_5: D?#47.5 R?#428.2
NetD?#47_11: D?#47.11(EPAD) R?#429.2
NetD?#48_5: D?#48.5 R?#432.2
NetD?#48_11: D?#48.11(EPAD) R?#434.2

Not connected (* = marked no-connect by the designer): D?#47 2 4 6 8(7) 10; D?#48 2 4 6 8(7) 10

### Notes on the sheet
- FOXVILLE RESET
- (near D?#47) DESIGN NOTE:
- ESD GND IS OPTIONAL
- To Enhance ESD Protection
- (near D?#48) CAD NOTE:
- PLACE THE ESD PROTECTION DIODE (ESD1014) CLOSE TO LAN CONNECTOR

### Library data of the parts
C?#268-C?#271 = Cap: CAP CER 0.1uF 50V X7R 0402
C?#272 = Cap: CAP CER 1nF 3KV X7R 1808
C?#273 = Cap: CAP CER 0.1uF 25V X7R 0402
D?#47 D?#48 = ESD1014MUTAG: ESD Suppressors / TVS Diodes LOW CAP TVS ARRAY
R?#424-R?#427 = Res: Thick Film Resistor - 75ohm, 1%, 0402
R?#428 R?#429 R?#431 R?#432 R?#434 R?#435 = Res: Thick Film Resistor -  0ohm, 1%, 0402
  R?#435: DNP: DNP
R?#430 = Res: Thick Film Resistor - 10Kohm, 1%, 0402
R?#433 = Res: Thick Film Resistor - 100Kohm, 1%, 0402
U?#10 = 74AHC1G08GW,125: Logic IC - Gate NXP Semiconductors 74AHC1G08GW, 125 AND gate 74AHC TSSOP 5; Manufacturer: Nexperia; Supplier 1: Digi-Key; Manufacturer Part Number: 74AHC1G08GW,125; Stock 1: 41783; Pricing 1: 1=0.27, 10=0.223, 25=0.1872, 100=0.1184, 250=0.0914, 500=0.0779, 1000=0.053 (USD); Case/Package: SOT-353; Supplier Part Number 1: 1727-3148-1-ND